# EAGLE design UDB5-v010 (EAGLE 6.4)

## Sheet 1 of 3
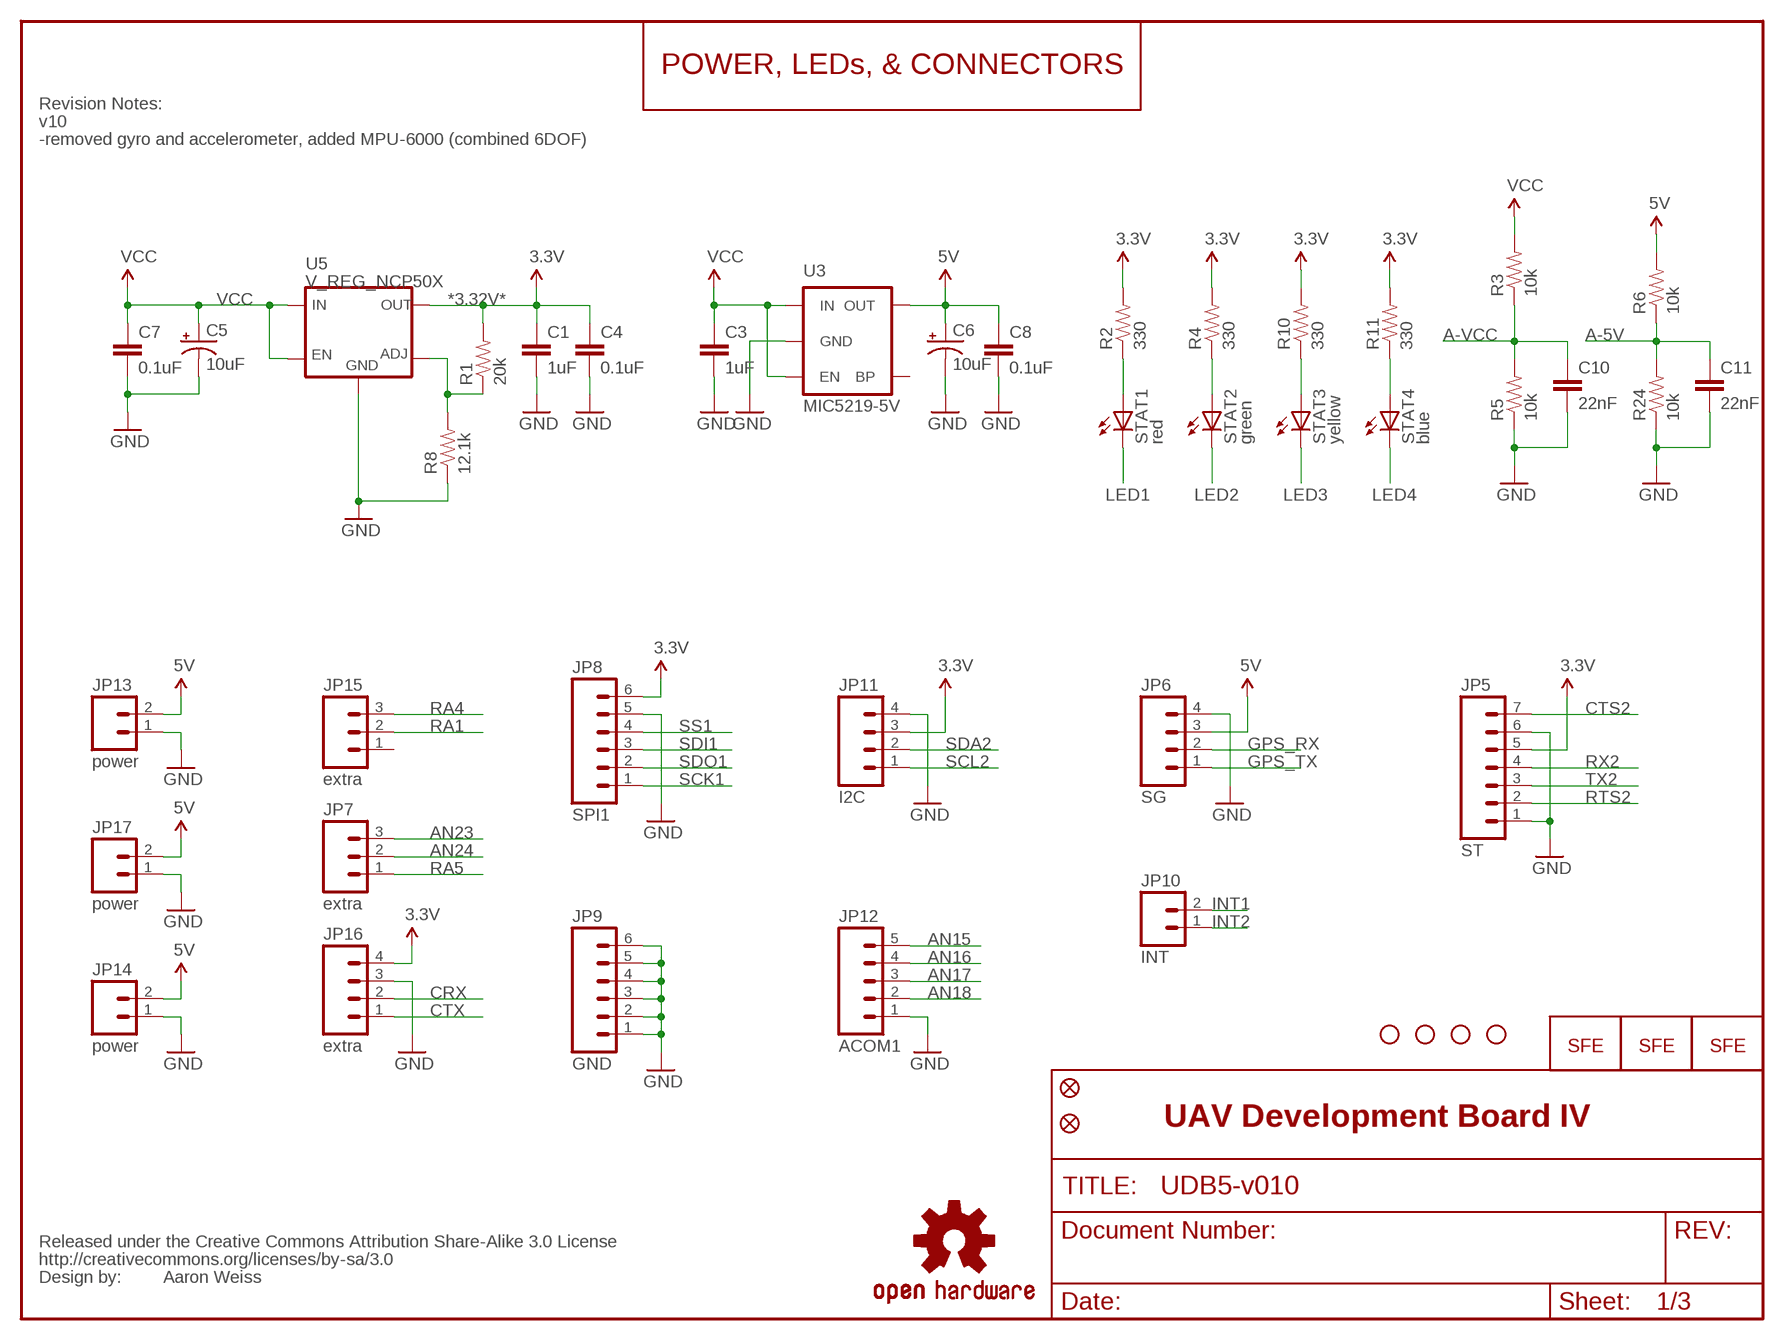
[diagram p0: schematic, sheet 1]

### Parts
C1  1uF  CAP0402-CAP  [0402-CAP]
C3  1uF  CAP0402-CAP  [0402-CAP]
C4  0.1uF  CAP0402-CAP  [0402-CAP]
C5  10uF  CAP_POL1206  [EIA3216]
C6  10uF  CAP_POL1206  [EIA3216]
C7  0.1uF  CAP0402-CAP  [0402-CAP]
C8  0.1uF  CAP0402-CAP  [0402-CAP]
C10  22nF  CAP0402-CAP  [0402-CAP]
C11  22nF  CAP0402-CAP  [0402-CAP]
CC_TEXT1  CREATIVE_COMMONS  [CREATIVE_COMMONS]
JP3  LOGO-SFENEW  [SFE-NEW-WEBLOGO]
JP5  ST  M07  [1X07]
JP6  SG  M04PTH  [1X04]
JP7  extra  M03PTH  [1X03]
JP8  SPI1  M06SIP  [1X06]
JP9  GND  M06SIP  [1X06]
JP10  INT  M02PTH  [1X02]
JP11  I2C  M04PTH  [1X04]
JP12  ACOM1  M05PTH  [1X05]
JP13  power  M02PTH  [1X02]
JP14  power  M02PTH  [1X02]
JP15  extra  M03PTH  [1X03]
JP16  extra  M04PTH  [1X04]
JP17  power  M02PTH  [1X02]
JP18  FIDUCIAL1X2.5  [FIDUCIAL-1X2.5]
JP19  FIDUCIAL1X2.5  [FIDUCIAL-1X2.5]
LOGO1  LOGO-SFENW2  [SFE-NEW-WEB]
R1  20k  RESISTOR0402-RES  [0402-RES]
R2  330  RESISTOR0402-RES  [0402-RES]
R3  10k  RESISTOR0402-RES  [0402-RES]
R4  330  RESISTOR0402-RES  [0402-RES]
R5  10k  RESISTOR0402-RES  [0402-RES]
R6  10k  RESISTOR0402-RES  [0402-RES]
R8  12.1k  RESISTOR0402-RES  [0402-RES]
R10  330  RESISTOR0402-RES  [0402-RES]
R11  330  RESISTOR0402-RES  [0402-RES]
R24  10k  RESISTOR0402-RES  [0402-RES]
STAT1  red  LED0603  [LED-0603]
STAT2  green  LED0603  [LED-0603]
STAT3  yellow  LED0603  [LED-0603]
STAT4  blue  LED0603  [LED-0603]
U3  V_REG_LDOSMD  [SOT23-5]
U5  V_REG_NCP50X  [DPAK-5]
U$2  STAND-OFF  [STAND-OFF]
U$3  STAND-OFF  [STAND-OFF]
U$4  STAND-OFF  [STAND-OFF]
U$5  STAND-OFF  [STAND-OFF]
U$9  OSHW-LOGOS  [OSHW-LOGO-S]
U$10  LOGO-SFESK  [SFE-LOGO-FLAME]

### Nets
3.3V: C1.1 C4.1 JP5.5 JP8.6 JP11.3 JP16.4 R1.2 R2.2 R4.2 R10.2 R11.2 U5.VOUT(OUT) ; also sheet 2,3
5V: C6.A(+) C8.1 JP6.3 JP13.2 JP14.2 JP17.2 R6.2 U3.5(OUT) ; also sheet 3
A-5V: C11.1 R6.1 R24.2 ; also sheet 2
A-VCC: C10.1 R3.1 R5.2 ; also sheet 2
AN15: JP12.5 ; also sheet 2
AN16: JP12.4 ; also sheet 2
AN17: JP12.3 ; also sheet 2
AN18: JP12.2 ; also sheet 2
AN23: JP7.3 ; also sheet 2
AN24: JP7.2 ; also sheet 2
CRX: JP16.2 ; also sheet 2
CTS2: JP5.7 ; also sheet 2
CTX: JP16.1 ; also sheet 2
GND: C1.2 C3.2 C4.2 C5.C(-) C6.C(-) C7.2 C8.2 C10.2 C11.2 JP5.1 JP5.6 JP6.4 JP8.5 JP9.1 JP9.2 JP9.3 JP9.4 JP9.5 JP9.6 JP11.4 JP12.1 JP13.1 JP14.1 JP16.3 JP17.1 R5.1 R8.1 R24.1 U3.2(GND) U5.GND ; also sheet 2,3
GPS_RX: JP6.2 ; also sheet 2,3
GPS_TX: JP6.1 ; also sheet 2,3
INT1: JP10.2 ; also sheet 2
INT2: JP10.1 ; also sheet 2
LED1: STAT1.C ; also sheet 2
LED2: STAT2.C ; also sheet 2
LED3: STAT3.C ; also sheet 2
LED4: STAT4.C ; also sheet 2
N$1: R2.1 STAT1.A
N$2: R4.1 STAT2.A
N$9: R1.1 R8.2 U5.ADJ
N$33: R10.1 STAT3.A
N$34: R11.1 STAT4.A
RA1: JP15.2 ; also sheet 2
RA4: JP15.3 ; also sheet 2
RA5: JP7.1 ; also sheet 2
RTS2: JP5.2 ; also sheet 2
RX2: JP5.4 ; also sheet 2
SCK1: JP8.1 ; also sheet 2
SCL2: JP11.1 ; also sheet 2
SDA2: JP11.2 ; also sheet 2
SDI1: JP8.3 ; also sheet 2
SDO1: JP8.2 ; also sheet 2
SS1: JP8.4 ; also sheet 2
TX2: JP5.3 ; also sheet 2
VCC: C3.1 C5.A(+) C7.1 R3.2 U3.1(IN) U3.3(EN) U5.EN U5.VIN(IN) ; also sheet 3
Unconnected: JP15.1 U3.4(BP)

### Notes on the sheet
- POWER, LEDs, & CONNECTORS
- Revision Notes:
- v10
- -removed gyro and accelerometer, added MPU-6000 (combined 6DOF)
- *3.32V*
- MIC5219-5V
- UAV Development Board IV
- Aaron Weiss

## Sheet 2 of 3
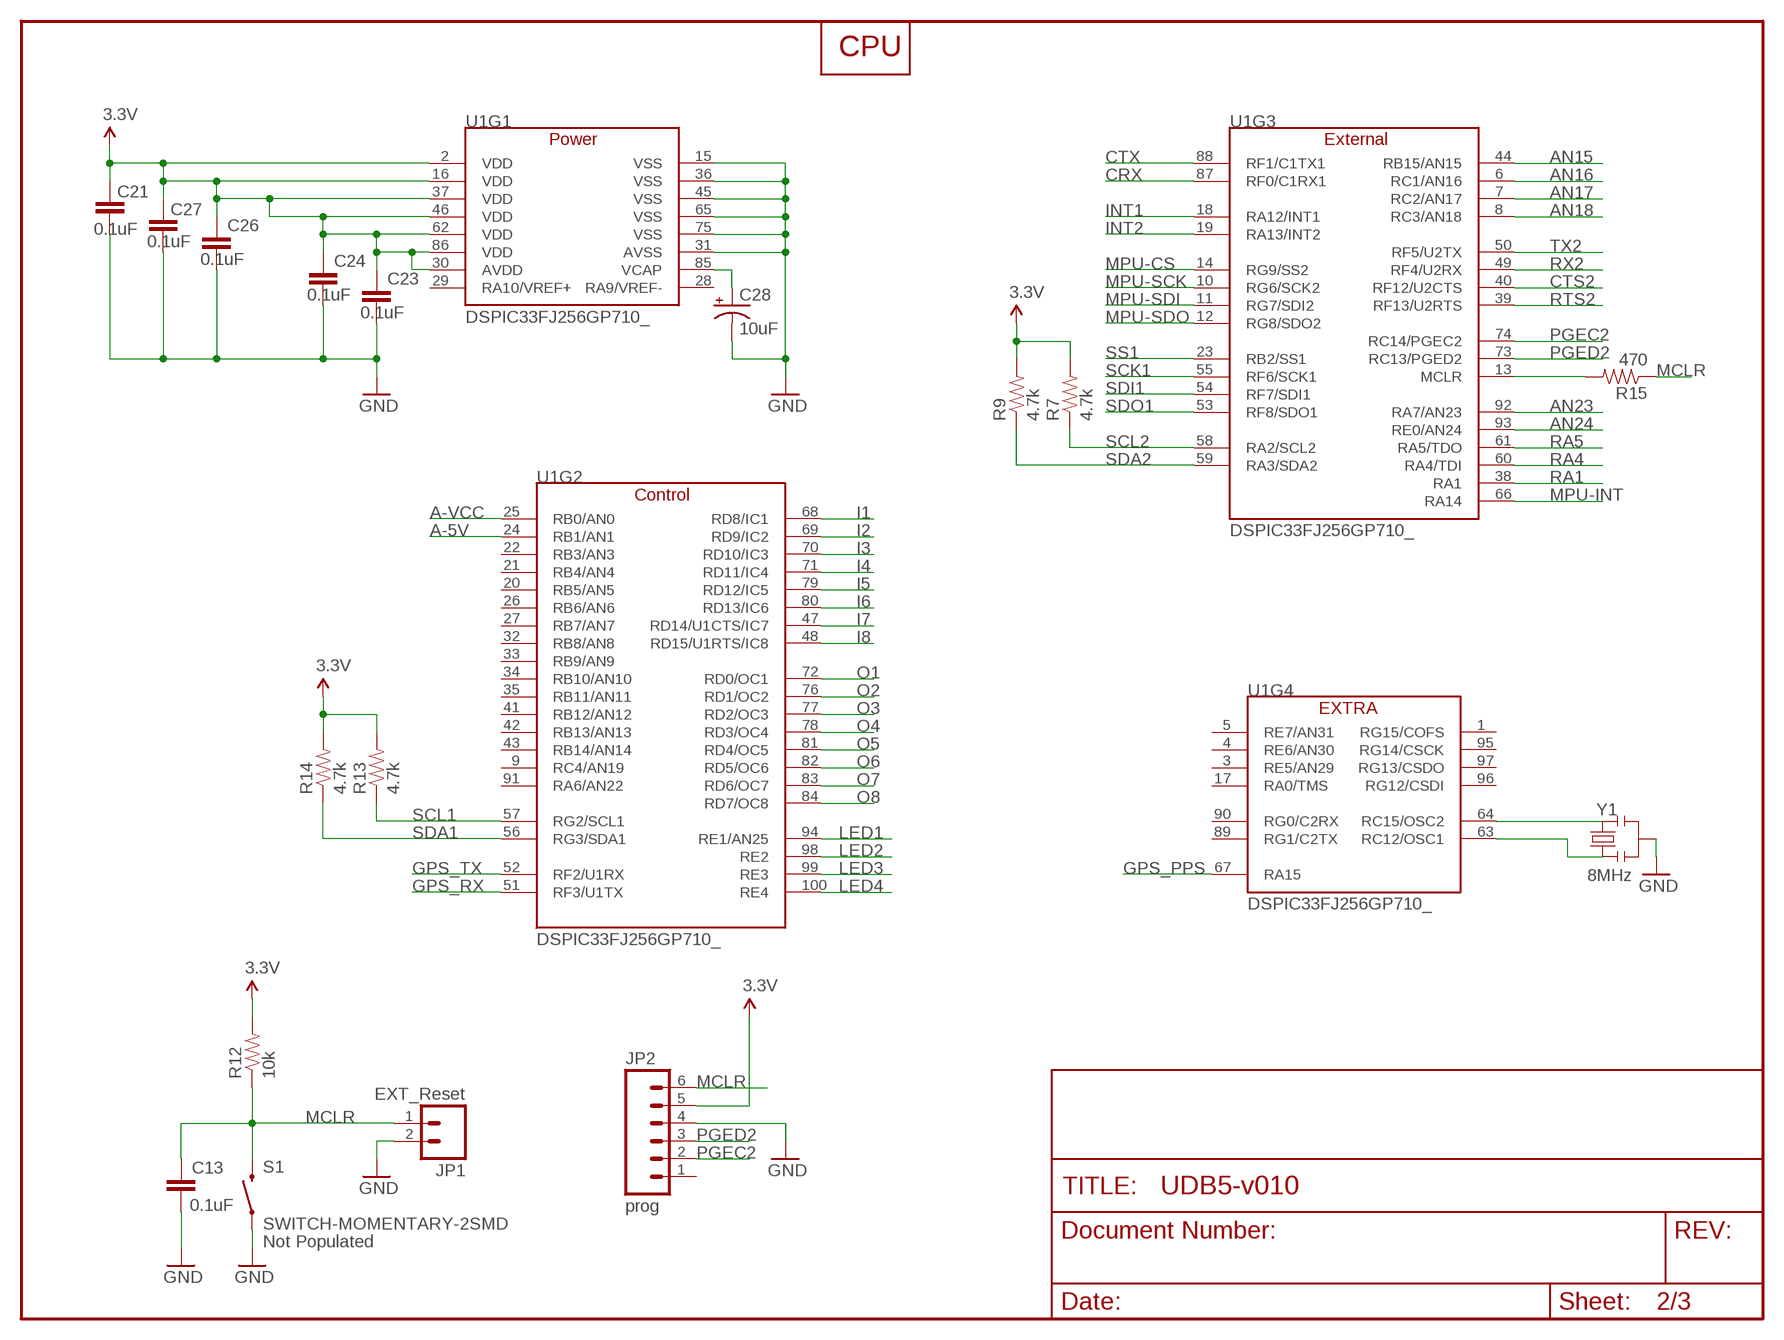
[diagram p1: schematic, sheet 2]

### Parts
C13  0.1uF  CAP0402-CAP  [0402-CAP]
C21  0.1uF  CAP0402-CAP  [0402-CAP]
C23  0.1uF  CAP0402-CAP  [0402-CAP]
C24  0.1uF  CAP0402-CAP  [0402-CAP]
C26  0.1uF  CAP0402-CAP  [0402-CAP]
C27  0.1uF  CAP0402-CAP  [0402-CAP]
C28  10uF  CAP_POL1206  [EIA3216]
JP1  EXT_Reset  M02PTH  [1X02]
JP2  prog  M06SIP  [1X06]
R7  4.7k  RESISTOR0402-RES  [0402-RES]
R9  4.7k  RESISTOR0402-RES  [0402-RES]
R12  10k  RESISTOR0402-RES  [0402-RES]
R13  4.7k  RESISTOR0402-RES  [0402-RES]
R14  4.7k  RESISTOR0402-RES  [0402-RES]
R15  470  RESISTOR0402-RES  [0402-RES]
S1  SWITCH-MOMENTARY-2SMD  [TACTILE_SWITCH_SMD]
U1  DSPIC33FJ256GP710_  [TQFP-100-12X12MM]
Y1  RESONATORSMD  [RESONATOR-SMD]

### Nets
3.3V: C21.1 C23.1 C24.1 C26.1 C27.1 JP2.5 R7.2 R9.2 R12.2 R13.2 R14.2 U1.2(VDD) U1.16(VDD) U1.30(AVDD) U1.37(VDD) U1.46(VDD) U1.62(VDD) U1.86(VDD) ; also sheet 1,3
A-5V: U1.24(RB1/AN1) ; also sheet 1
A-VCC: U1.25(RB0/AN0) ; also sheet 1
AN15: U1.44(RB15/AN15) ; also sheet 1
AN16: U1.6(RC1/AN16) ; also sheet 1
AN17: U1.7(RC2/AN17) ; also sheet 1
AN18: U1.8(RC3/AN18) ; also sheet 1
AN23: U1.92(RA7/AN23) ; also sheet 1
AN24: U1.93(RE0/AN24) ; also sheet 1
CRX: U1.87(RF0/C1RX1) ; also sheet 1
CTS2: U1.40(RF12/U2CTS) ; also sheet 1
CTX: U1.88(RF1/C1TX1) ; also sheet 1
GND: C13.2 C21.2 C23.2 C24.2 C26.2 C27.2 C28.C(-) JP1.2 JP2.4 S1.1 U1.15(VSS) U1.31(AVSS) U1.36(VSS) U1.45(VSS) U1.65(VSS) U1.75(VSS) Y1.2 ; also sheet 1,3
GPS_PPS: U1.67(RA15) ; also sheet 3
GPS_RX: U1.51(RF3/U1TX) ; also sheet 1,3
GPS_TX: U1.52(RF2/U1RX) ; also sheet 1,3
I1: U1.68(RD8/IC1) ; also sheet 3
I2: U1.69(RD9/IC2) ; also sheet 3
I3: U1.70(RD10/IC3) ; also sheet 3
I4: U1.71(RD11/IC4) ; also sheet 3
I5: U1.79(RD12/IC5) ; also sheet 3
I6: U1.80(RD13/IC6) ; also sheet 3
I7: U1.47(RD14/U1CTS/IC7) ; also sheet 3
I8: U1.48(RD15/U1RTS/IC8) ; also sheet 3
INT1: U1.18(RA12/INT1) ; also sheet 1
INT2: U1.19(RA13/INT2) ; also sheet 1
LED1: U1.94(RE1/AN25) ; also sheet 1
LED2: U1.98(RE2) ; also sheet 1
LED3: U1.99(RE3) ; also sheet 1
LED4: U1.100(RE4) ; also sheet 1
MCLR: C13.1 JP1.1 JP2.6 R12.1 R15.1 S1.3
MPU-CS: U1.14(RG9/SS2) ; also sheet 3
MPU-INT: U1.66(RA14) ; also sheet 3
MPU-SCK: U1.10(RG6/SCK2) ; also sheet 3
MPU-SDI: U1.11(RG7/SDI2) ; also sheet 3
MPU-SDO: U1.12(RG8/SDO2) ; also sheet 3
N$3: U1.64(RC15/OSC2) Y1.3
N$6: U1.63(RC12/OSC1) Y1.1
N$7: R15.2 U1.13(MCLR)
N$35: C28.A(+) U1.85(VCAP)
O1: U1.72(RD0/OC1) ; also sheet 3
O2: U1.76(RD1/OC2) ; also sheet 3
O3: U1.77(RD2/OC3) ; also sheet 3
O4: U1.78(RD3/OC4) ; also sheet 3
O5: U1.81(RD4/OC5) ; also sheet 3
O6: U1.82(RD5/OC6) ; also sheet 3
O7: U1.83(RD6/OC7) ; also sheet 3
O8: U1.84(RD7/OC8) ; also sheet 3
PGEC2: JP2.2 U1.74(RC14/PGEC2)
PGED2: JP2.3 U1.73(RC13/PGED2)
RA1: U1.38(RA1) ; also sheet 1
RA4: U1.60(RA4/TDI) ; also sheet 1
RA5: U1.61(RA5/TDO) ; also sheet 1
RTS2: U1.39(RF13/U2RTS) ; also sheet 1
RX2: U1.49(RF4/U2RX) ; also sheet 1
SCK1: U1.55(RF6/SCK1) ; also sheet 1
SCL1: R13.1 U1.57(RG2/SCL1) ; also sheet 3
SCL2: R7.1 U1.58(RA2/SCL2) ; also sheet 1
SDA1: R14.1 U1.56(RG3/SDA1) ; also sheet 3
SDA2: R9.1 U1.59(RA3/SDA2) ; also sheet 1
SDI1: U1.54(RF7/SDI1) ; also sheet 1
SDO1: U1.53(RF8/SDO1) ; also sheet 1
SS1: U1.23(RB2/SS1) ; also sheet 1
TX2: U1.50(RF5/U2TX) ; also sheet 1
Unconnected: JP2.1 U1.1(RG15/COFS) U1.3(RE5/AN29) U1.4(RE6/AN30) U1.5(RE7/AN31) U1.9(RC4/AN19) U1.17(RA0/TMS) U1.20(RB5/AN5) U1.21(RB4/AN4) U1.22(RB3/AN3) U1.26(RB6/AN6) U1.27(RB7/AN7) U1.28(RA9/VREF-) U1.29(RA10/VREF+) U1.32(RB8/AN8) U1.33(RB9/AN9) U1.34(RB10/AN10) U1.35(RB11/AN11) U1.41(RB12/AN12) U1.42(RB13/AN13) U1.43(RB14/AN14) U1.89(RG1/C2TX) U1.90(RG0/C2RX) U1.91(RA6/AN22) U1.95(RG14/CSCK) U1.96(RG12/CSDI) U1.97(RG13/CSDO)

### Notes on the sheet
- CPU
- 8MHz
- Not Populated

## Sheet 3 of 3
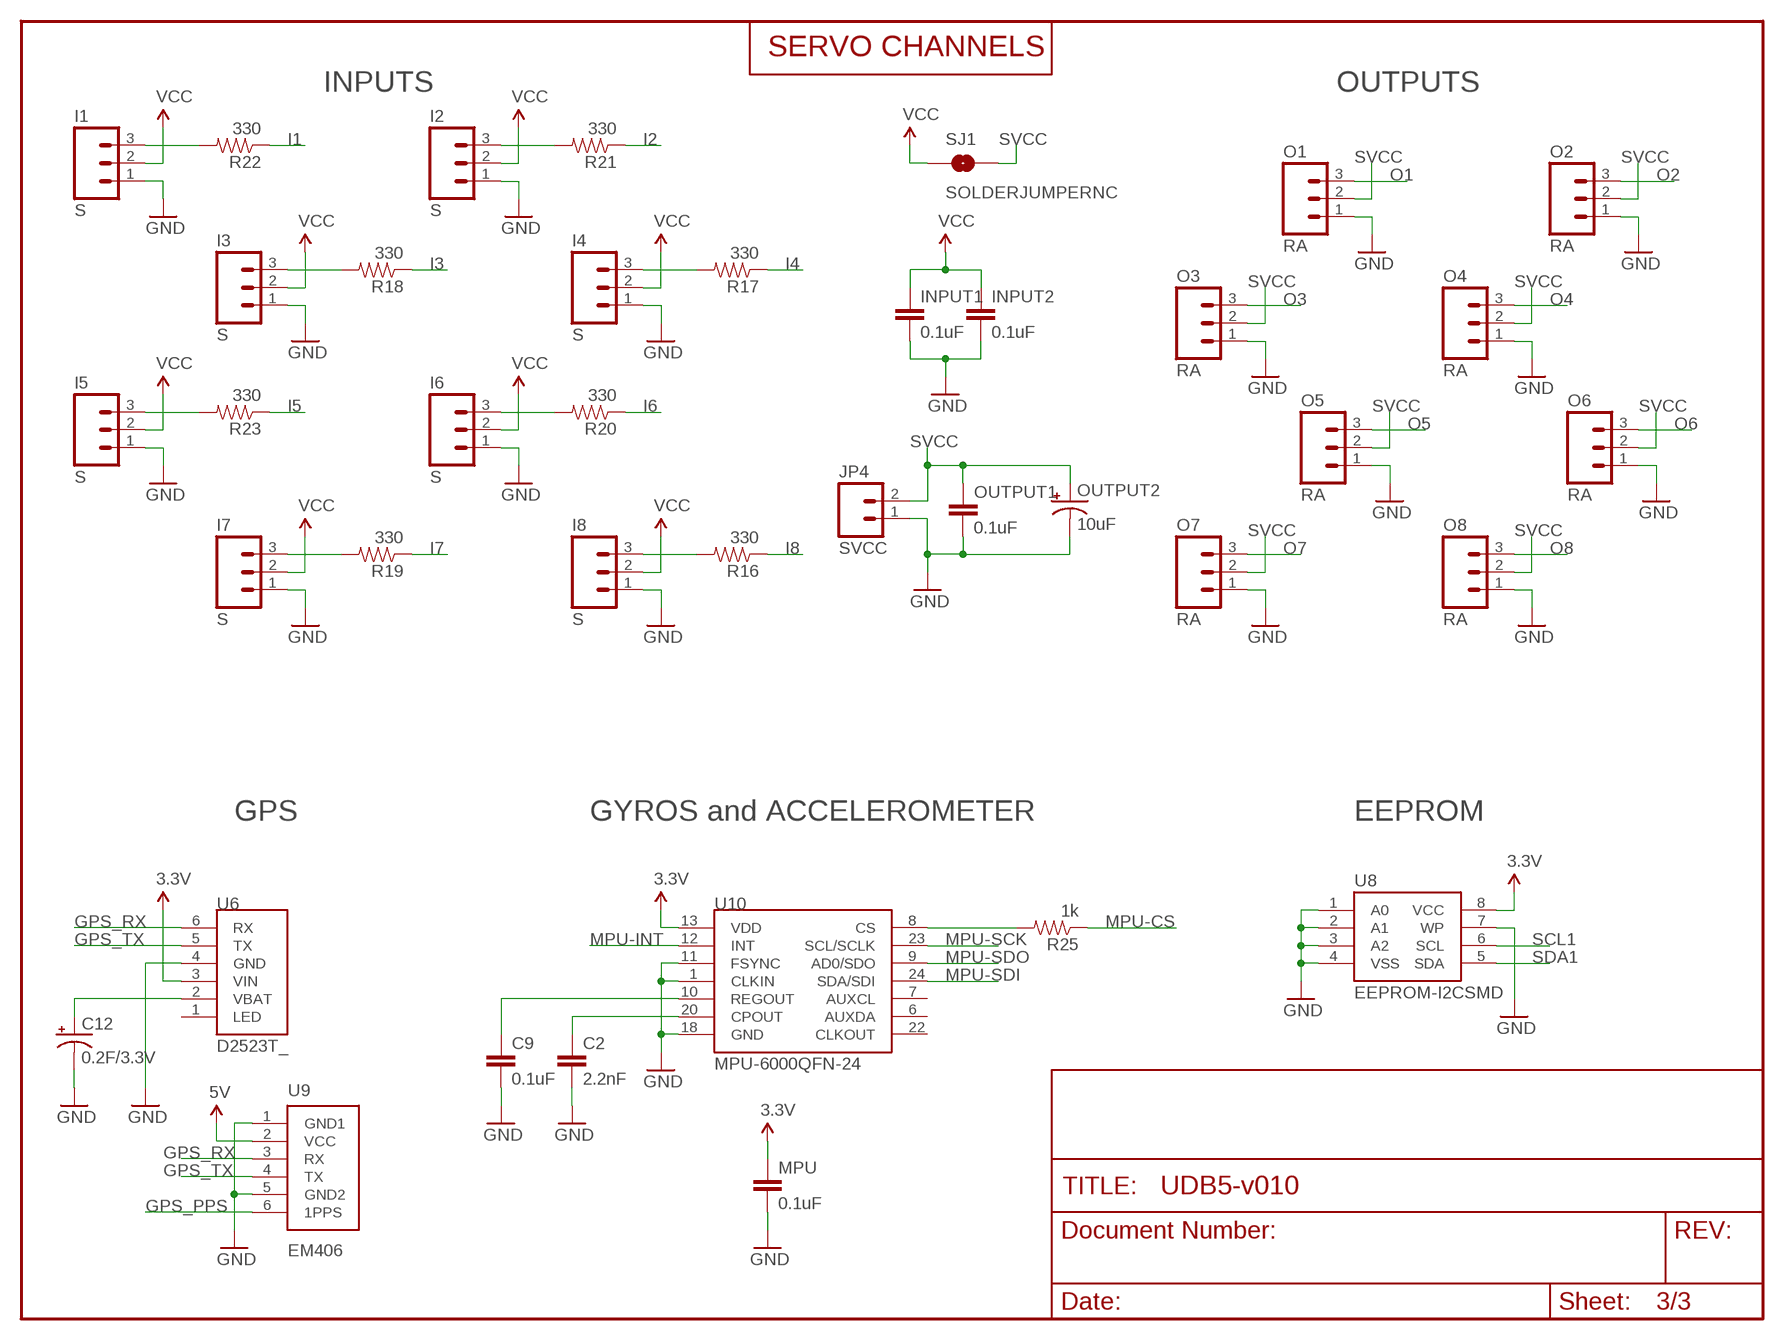
[diagram p2: schematic, sheet 3]

### Parts
C2  2.2nF  CAP0402-CAP  [0402-CAP]
C9  0.1uF  CAP0402-CAP  [0402-CAP]
C12  0.2F/3.3V  CAP_POLEN_J2  [EN_J2]
I1  S  M03PTH  [1X03]
I2  S  M03PTH  [1X03]
I3  S  M03PTH  [1X03]
I4  S  M03PTH  [1X03]
I5  S  M03PTH  [1X03]
I6  S  M03PTH  [1X03]
I7  S  M03PTH  [1X03]
I8  S  M03PTH  [1X03]
INPUT1  0.1uF  CAP0402-CAP  [0402-CAP]
INPUT2  0.1uF  CAP0402-CAP  [0402-CAP]
JP4  SVCC  M02PTH  [1X02]
MPU  0.1uF  CAP0402-CAP  [0402-CAP]
O1  RA  M03PTH  [1X03]
O2  RA  M03PTH  [1X03]
O3  RA  M03PTH  [1X03]
O4  RA  M03PTH  [1X03]
O5  RA  M03PTH  [1X03]
O6  RA  M03PTH  [1X03]
O7  RA  M03PTH  [1X03]
O8  RA  M03PTH  [1X03]
OUTPUT1  0.1uF  CAP0402-CAP  [0402-CAP]
OUTPUT2  10uF  CAP_POL1206  [EIA3216]
R16  330  RESISTOR0402-RES  [0402-RES]
R17  330  RESISTOR0402-RES  [0402-RES]
R18  330  RESISTOR0402-RES  [0402-RES]
R19  330  RESISTOR0402-RES  [0402-RES]
R20  330  RESISTOR0402-RES  [0402-RES]
R21  330  RESISTOR0402-RES  [0402-RES]
R22  330  RESISTOR0402-RES  [0402-RES]
R23  330  RESISTOR0402-RES  [0402-RES]
R25  1k  RESISTOR0402-RES  [0402-RES]
SJ1  SOLDERJUMPERNC  [SJ_2S]
U6  D2523T_  [EM406]
U8  EEPROM-I2CSMD  [SO08]
U9  EM406  [EM406]
U10  MPU-6000QFN-24  [QFN-24-TESTING]

### Nets
3.3V: MPU.1 U6.3(VIN) U8.8(VCC) U10.13(VDD) ; also sheet 1,2
5V: U9.2(VCC) ; also sheet 1
GND: C2.2 C9.2 C12.- I1.1 I2.1 I3.1 I4.1 I5.1 I6.1 I7.1 I8.1 INPUT1.2 INPUT2.2 JP4.1 MPU.2 O1.1 O2.1 O3.1 O4.1 O5.1 O6.1 O7.1 O8.1 OUTPUT1.2 OUTPUT2.C(-) U6.4(GND) U8.1(A0) U8.2(A1) U8.3(A2) U8.4(VSS) U8.7(WP) U9.1(GND1) U9.5(GND2) U10.1(CLKIN) U10.11(FSYNC) U10.18(GND) ; also sheet 1,2
GPS_PPS: U9.6(1PPS) ; also sheet 2
GPS_RX: U6.6(RX) U9.3(RX) ; also sheet 1,2
GPS_TX: U6.5(TX) U9.4(TX) ; also sheet 1,2
I1: R22.1 ; also sheet 2
I2: R21.1 ; also sheet 2
I3: R18.1 ; also sheet 2
I4: R17.1 ; also sheet 2
I5: R23.1 ; also sheet 2
I6: R20.1 ; also sheet 2
I7: R19.1 ; also sheet 2
I8: R16.1 ; also sheet 2
MPU-CS: R25.1 ; also sheet 2
MPU-INT: U10.12(INT) ; also sheet 2
MPU-SCK: U10.23(SCL/SCLK) ; also sheet 2
MPU-SDI: U10.24(SDA/SDI) ; also sheet 2
MPU-SDO: U10.9(AD0/SDO) ; also sheet 2
N$4: C12.+ U6.2(VBAT)
N$5: R25.2 U10.8(CS)
N$13: C2.1 U10.20(CPOUT)
N$14: I8.3 R16.2
N$15: I4.3 R17.2
N$16: C9.1 U10.10(REGOUT)
N$17: I3.3 R18.2
N$18: I7.3 R19.2
N$19: I6.3 R20.2
N$20: I2.3 R21.2
N$21: I1.3 R22.2
N$27: I5.3 R23.2
O1: O1.3 ; also sheet 2
O2: O2.3 ; also sheet 2
O3: O3.3 ; also sheet 2
O4: O4.3 ; also sheet 2
O5: O5.3 ; also sheet 2
O6: O6.3 ; also sheet 2
O7: O7.3 ; also sheet 2
O8: O8.3 ; also sheet 2
SCL1: U8.6(SCL) ; also sheet 2
SDA1: U8.5(SDA) ; also sheet 2
SVCC: JP4.2 O1.2 O2.2 O3.2 O4.2 O5.2 O6.2 O7.2 O8.2 OUTPUT1.1 OUTPUT2.A(+) SJ1.2
VCC: I1.2 I2.2 I3.2 I4.2 I5.2 I6.2 I7.2 I8.2 INPUT1.1 INPUT2.1 SJ1.1 ; also sheet 1
Unconnected: U6.1(LED) U10.6(AUXDA) U10.7(AUXCL) U10.22(CLKOUT)

### Notes on the sheet
- SERVO CHANNELS
- INPUTS | OUTPUTS
- GPS | GYROS and ACCELEROMETER | EEPROM

## Library data of the parts
C1 C3 C4 C7 C8 C10 C11 C13 C21 C23 C24 C26 C27 INPUT1 INPUT2 MPU OUTPUT1 = SparkFun:CAP: Capacitor Standard 0603 ceramic capacitor, and 0.1" leaded capacitor.
C2 C9 = SparkFun-Capacitors:CAP: Capacitor Standard 0603 ceramic capacitor, and 0.1" leaded capacitor.
C5 C6 C28 OUTPUT2 = SparkFun:CAP_POL: Capacitor Polarized These are standard SMD and PTH capacitors. Normally 10uF, 47uF, and 100uF in electrolytic and tantalum varieties. Always verify the external diameter of the through hole cap, it varies with capacity, voltage, and manufacturer. The EIA devices should be standard.
C12 = SparkFun-Capacitors:CAP_POL: Capacitor Polarized These are standard SMD and PTH capacitors. Normally 10uF, 47uF, and 100uF in electrolytic and tantalum varieties. Always verify the external diameter of the through hole cap, it varies with capacity, voltage, and manufacturer. The EIA devices should be standard.
CC_TEXT1 = SparkFun-Aesthetics:CREATIVE_COMMONS: Creative Commons License summary
I1-I8 JP7 JP15 O1-O8 = SparkFun:M03: Header 3 Standard 3-pin 0.1" header. Use with straight break away headers (SKU : PRT-00116), right angle break away headers (PRT-00553), swiss pins (PRT-00743), machine pins (PRT-00117), and female headers (PRT-00115). Molex polarized connector foot print use with SKU : PRT-08232 with associated crimp pins and housings.
JP1 JP4 JP10 JP13 JP14 JP17 = SparkFun:M02: Header 2 Standard 2-pin 0.1" header. Use with straight break away headers (SKU : PRT-00116), right angle break away headers (PRT-00553), swiss pins (PRT-00743), machine pins (PRT-00117), and female headers (PRT-00115). Molex polarized connector foot print use with SKU : PRT-08233 with associated crimp pins and housings.
JP2 JP8 = SparkFun:M06: Header 6 Standard 6-pin 0.1" header. Use with straight break away headers (SKU : PRT-00116), right angle break away headers (PRT-00553), swiss pins (PRT-00743), machine pins (PRT-00117), and female headers (PRT-00115). Molex polarized connector foot print use with SKU : PRT-08094 with associated crimp pins and housings. NOTES ON THE VARIANTS LOCK and LOCK_LONGPADS... This footprint was designed to help hold the alignment of a through-hole component (i.e. 6-pin header) while soldering it into place. You may notice that each hole has been shifted either up or down by 0.005 of an inch from it's more standard position (which is a perfectly straight line). This slight alteration caused the pins (the squares in the middle) to touch the edges of the holes. Because they are alternating, it causes a "brace" to hold the component in place. 0.005 has proven to be the perfect amount of "off-center" position when using our standard breakaway headers. Although looks a little odd when you look at the bare footprint, once you have a header in there, the alteration is very hard to notice. Also, if you push a header all the way into place, it is covered up entirely on the bottom side. This idea of altering the position of holes to aid alignment will be further integrated into the Sparkfun Library for other footprints. It can help hold any component with 3 or more connection pins.
JP3 U$10 = SparkFun:LOGO-SFE: Spark Fun Electronics PCB Logo This is the standard Spark Fun Electronics PCB logo.
JP5 = SparkFun:M07: Header 7 Standard 7-pin 0.1" header. Use with straight break away headers (SKU : PRT-00116), right angle break away headers (PRT-00553), swiss pins (PRT-00743), machine pins (PRT-00117), and female headers (PRT-00115). NOTES ON THE VARIANTS LOCK and LOCK_LONGPADS... This footprint was designed to help hold the alignment of a through-hole component (i.e. 7-pin header) while soldering it into place. You may notice that each hole has been shifted either up or down by 0.005 of an inch from it's more standard position (which is usually a perfectly straight line). This slight alteration caused the pins (the squares in the middle) to touch the edges of the holes. Because they are alternating, it causes a "brace" to hold the header in place. 0.005 has proven to be the perfect amount of "off-center" position when using our standard breakaway headers. Although looks a little odd when you look at the bare footprint, once you have a header in there, the alteration is very hard to notice. Also, if you push a header all the way into place, it is covered up entirely on the bottom side. This idea of altering the position of holes to aid alignment will be further integrated into the Sparkfun Library for other footprints. It can help hold any component with 3 or more connection pins.
JP6 JP11 JP16 = SparkFun:M04: Header 4 Standard 4-pin 0.1" header. Use with straight break away headers (SKU : PRT-00116), right angle break away headers (PRT-00553), swiss pins (PRT-00743), machine pins (PRT-00117), and female headers (PRT-00115). Molex polarized connector foot print use with SKU : PRT-08231 with associated crimp pins and housings. 1MM SMD Version SKU: PRT-10208
JP9 = SparkFun-Connectors:M06: Header 6 Standard 6-pin 0.1" header. Use with straight break away headers (SKU : PRT-00116), right angle break away headers (PRT-00553), swiss pins (PRT-00743), machine pins (PRT-00117), and female headers (PRT-00115). Molex polarized connector foot print use with SKU : PRT-08094 with associated crimp pins and housings. NOTES ON THE VARIANTS LOCK and LOCK_LONGPADS... This footprint was designed to help hold the alignment of a through-hole component (i.e. 6-pin header) while soldering it into place. You may notice that each hole has been shifted either up or down by 0.005 of an inch from it's more standard position (which is a perfectly straight line). This slight alteration caused the pins (the squares in the middle) to touch the edges of the holes. Because they are alternating, it causes a "brace" to hold the component in place. 0.005 has proven to be the perfect amount of "off-center" position when using our standard breakaway headers. Although looks a little odd when you look at the bare footprint, once you have a header in there, the alteration is very hard to notice. Also, if you push a header all the way into place, it is covered up entirely on the bottom side. This idea of altering the position of holes to aid alignment will be further integrated into the Sparkfun Library for other footprints. It can help hold any component with 3 or more connection pins.
JP12 = SparkFun:M05: Header 5 Standard 5-pin 0.1" header. Use with straight break away headers (SKU : PRT-00116), right angle break away headers (PRT-00553), swiss pins (PRT-00743), machine pins (PRT-00117), and female headers (PRT-00115). Molex polarized connector foot print use with SKU : PRT-08230 with associated crimp pins and housings.
JP18 JP19 = abes:FIDUCIAL: Fiducial Alignment Points Various fiducial points for machine vision alignment.
LOGO1 = SparkFun-Aesthetics:LOGO-SFE: Spark Fun Electronics PCB Logo This is the standard Spark Fun Electronics PCB logo.
R1-R25 = SparkFun:RESISTOR: Resistor Basic schematic elements and footprints for 0603, 1206, and PTH resistors.
S1 = SparkFun:SWITCH-MOMENTARY-2
SJ1 = SparkFun:SOLDERJUMPER: Solder Jumper Standard SMD solder jumper. Used to automate production. Two varients : Normally Open and Normally Closed are the same, but have different paste layers. NC will have a large amount of paste and should jumper during reflow.
STAT1-STAT4 = SparkFun:LED: LEDs Standard schematic elements and footprints for 5mm, 3mm, 1206, and 0603 sized LEDs. 5mm - Spark Fun Electronics SKU : COM-00529 (and others)
U1 = SparkFun:DSPIC33FJ256GP710
U3 = SparkFun:V_REG_LDO: Voltage Regulator LDO Standard 150mA LDO voltage regulator in SOT-23 layout. Micrel part MIC5205. BP (by-pass) pin is used to lower output noise with 470pF cap.
U5 = SparkFun:V_REG_NCP50X: NCP550x 500mA LDO Voltage Regulator
U6 = SparkFun:D2523T: D2523T GPS Module
U8 = SparkFun:EEPROM-I2C
U9 = SparkFun:EM406: EM406 Connector Proven layout and schematic for EM406 connector. Spark Fun Electronics SKU : GPS-00579
U10 = SparkFun-Sensors:MPU-6000: MPU-6000 - I2C address is 0x68 with AD0 low and 0x69 with AD0 high.
U$2-U$5 = SparkFun:STAND-OFF: Stand Off This is the mechanical footprint for a #4 phillips button head screw. Use the keepout ring to avoid running the screw head into surrounding components. SKU : PRT-00447
U$9 = SparkFun:OSHW-LOGO: Open Source Hardware Logo This logo indicates the piece of hardware it is found on incorporates a OSHW license and/or adheres to the definition of open source hardware found here: http://freedomdefined.org/OSHW
Y1 = SparkFun:RESONATOR: Resonator Small SMD resonator. This is the itty bitty 10/20MHz resonators with built in caps. CSTCE10M0G55 and CSTCE20M0V53. Footprint has been reviewed closely but hasn't been tested yet.

## Net classes
1 antenna: width 2.974 mm

## Board
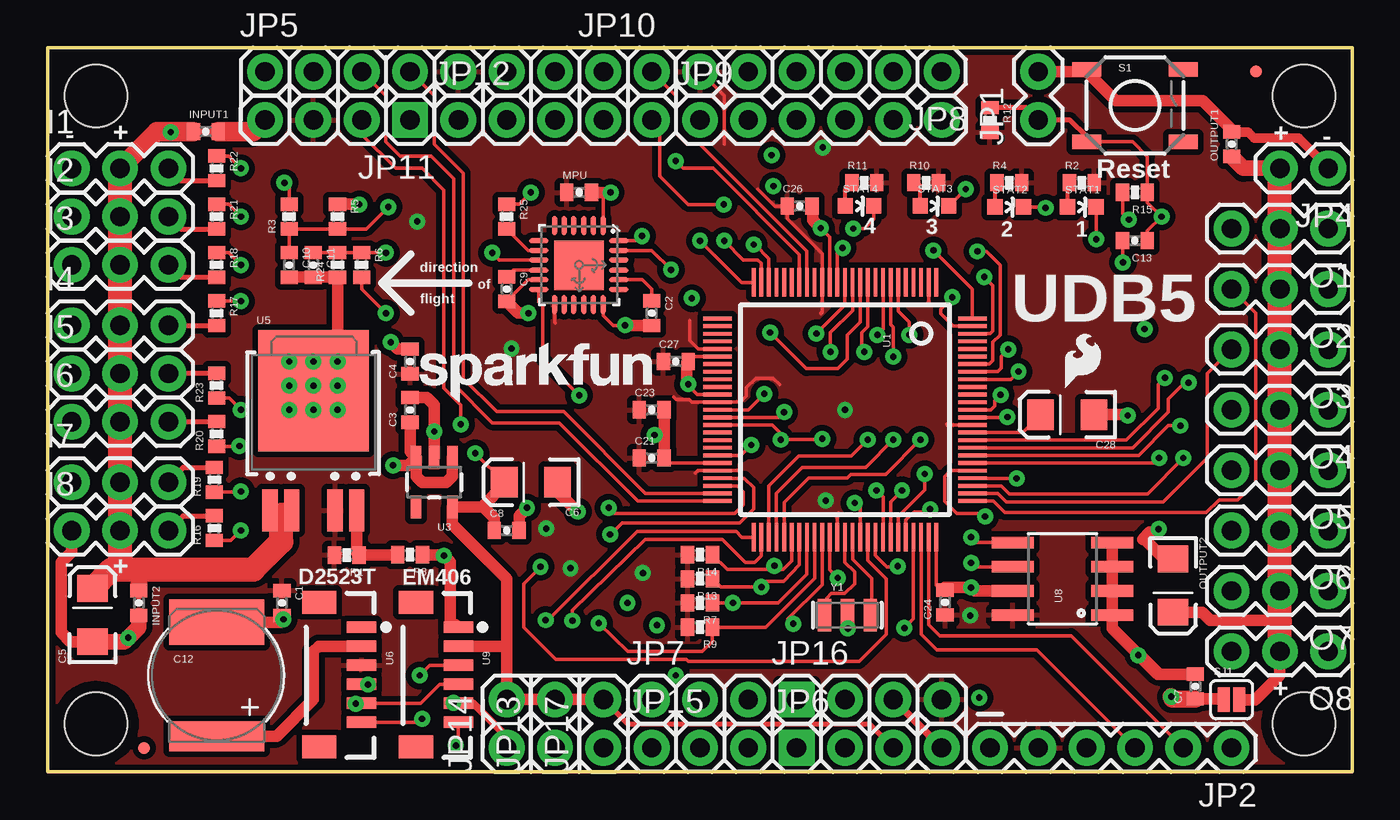
[diagram p3: board, top side]
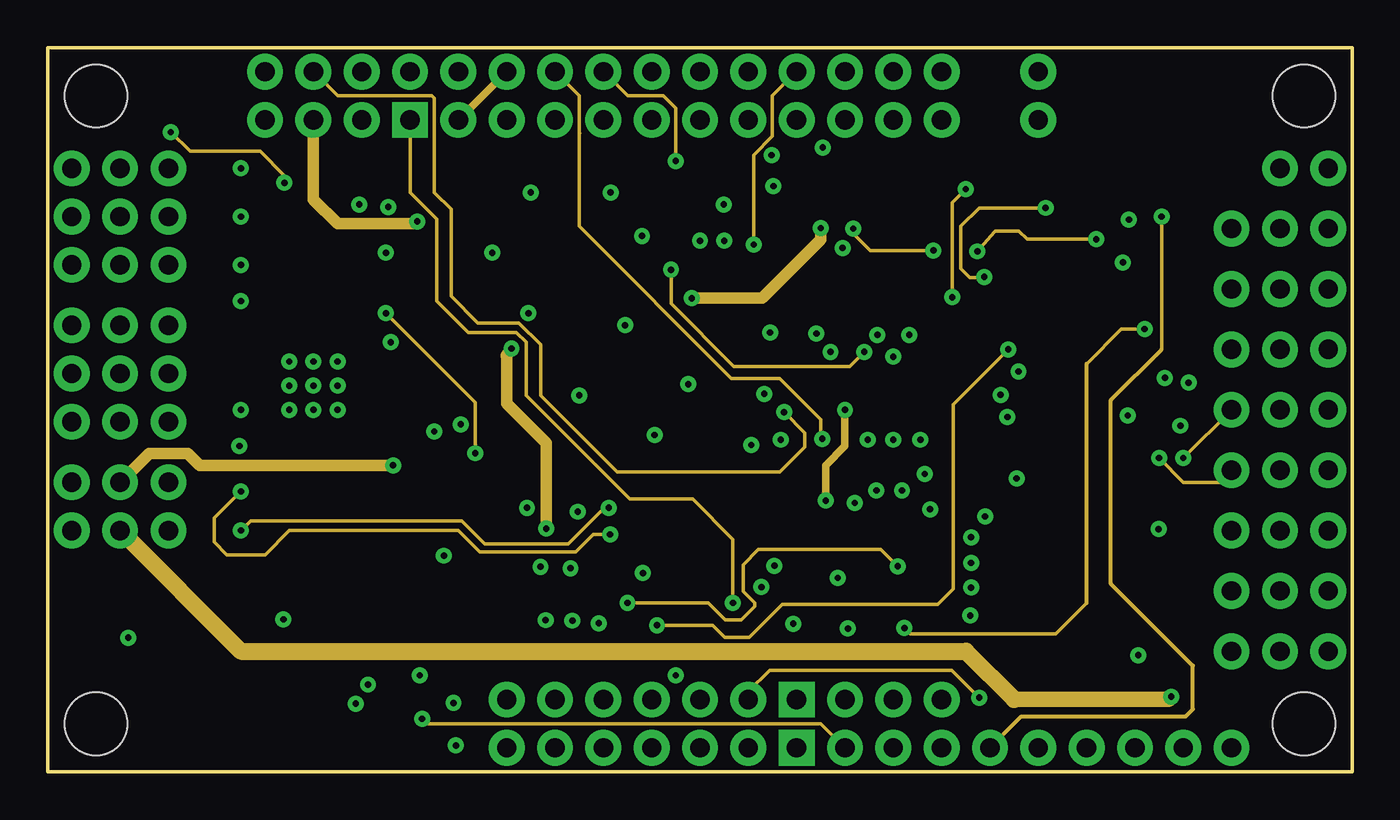
[diagram p4: board, inner layer Route5]
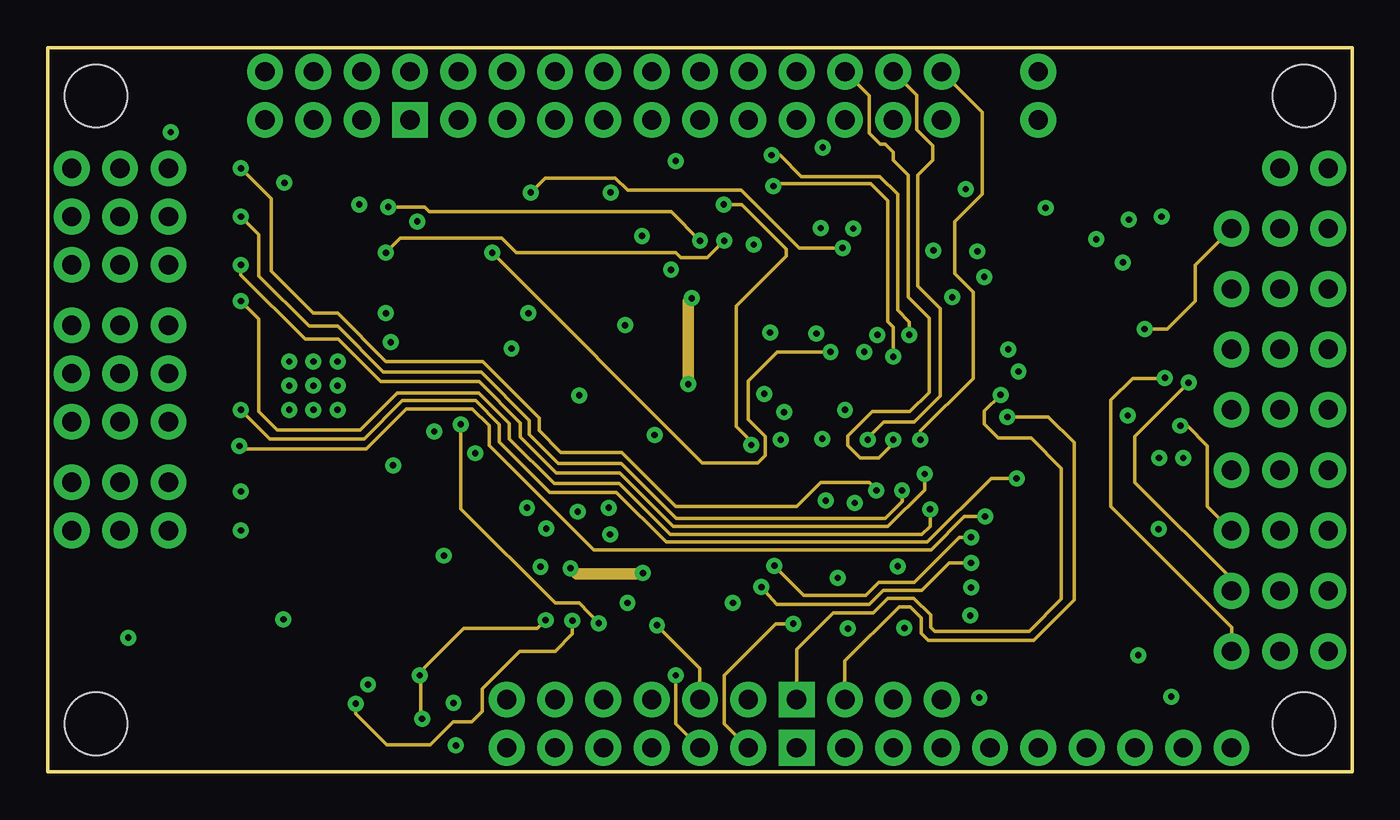
[diagram p5: board, inner layer Route10]
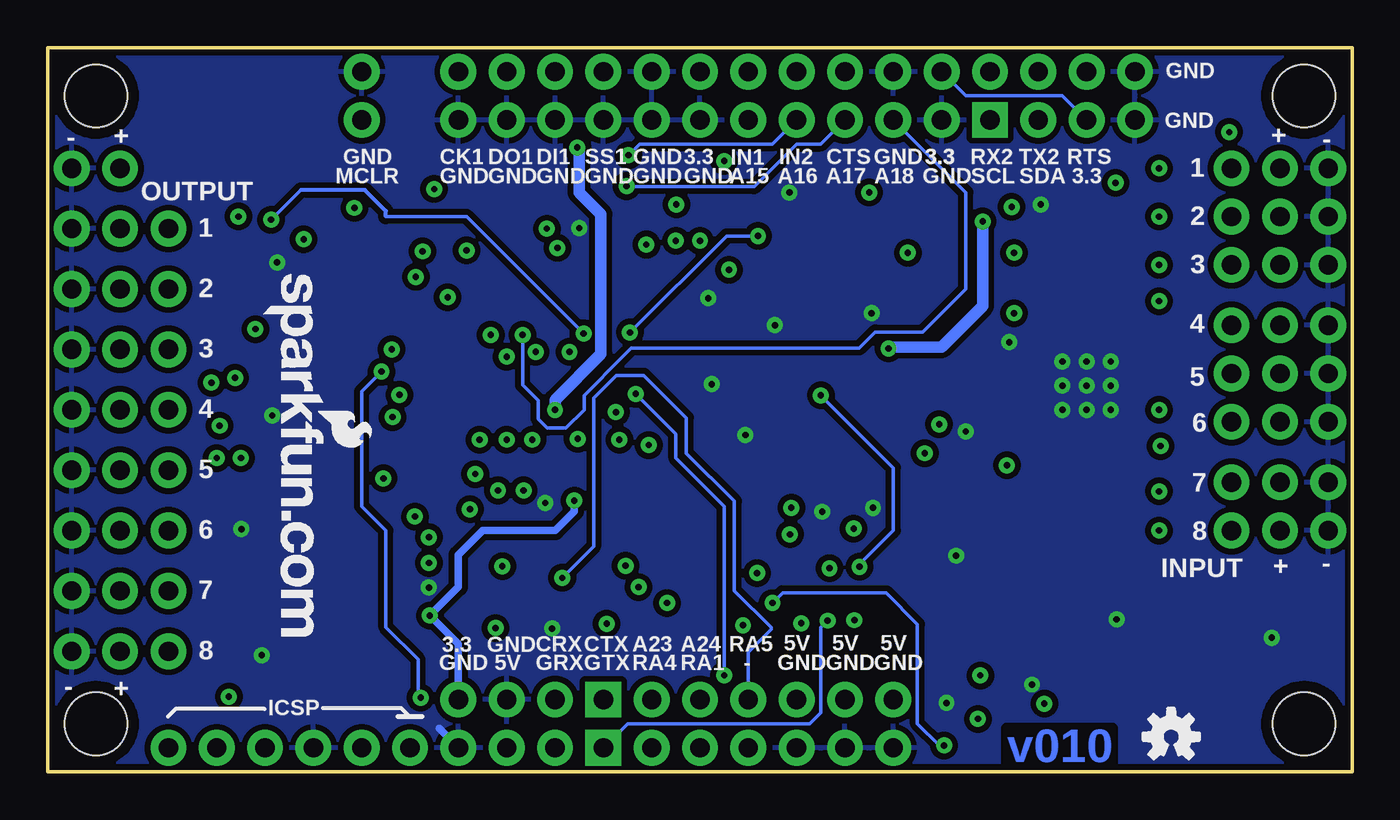
[diagram p6: board, bottom side, seen from below]

Size 68.58 x 38.1 mm. Coordinates in mm from the lower left corner, seen from the top.
Outline: 0,0 68.58,0 68.58,38.1 0,38.1 0,0
Copper layers (1*5*10*16): Top 0.035mm / dielectric 1.5mm / Route5 0.035mm / dielectric 0.2mm / Route10 0.035mm / dielectric 0.15mm / Bottom 0.035mm
Design rules "BatchPCB-4-layer *": minimum track width 6mil, minimum drill 13mil, track to track 6mil, track to pad 6mil, pad to pad 6mil, via to via 6mil, smd to smd 6mil, copper to edge 6mil, drill to drill 8mil, minimum pad ring 12mil, minimum via ring 10mil, stop-mask expansion 4mil, vias tented up to drill 20mil, thermal gap 12mil

### Footprints (pad centres in the part's own frame; a part is rotated, then mirrored left to right if it is on the bottom)
0402-CAP = smd 0.7 x 0.9: 1 -0.65,0; 2 0.65,0
EIA3216 = smd 1.4 x 1.6: A 1.4,0; C -1.4,0
EN_J2 = smd 5 x 1.6: + 0,-3.2 | smd 5 x 2.4: - 0,2.8
1X03 = drill 1.016 pad 1.88: 1 0,0; 2 2.54,0; 3 5.08,0
1X02 = drill 1.016 pad 1.88: 1 0,0; 2 2.54,0
1X06 = drill 1.016 pad 1.88: 1 0,0; 2 2.54,0; 3 5.08,0; 4 7.62,0; 5 10.16,0; 6 12.7,0
1X07 = drill 1.016 pad 1.88: 1 0,0; 2 2.54,0; 3 5.08,0; 4 7.62,0; 5 10.16,0; 6 12.7,0; 7 15.24,0
1X04 = drill 1.016 pad 1.88 square: 1 0,0 | drill 1.016 pad 1.88: 2 2.54,0; 3 5.08,0; 4 7.62,0
1X05 = drill 1.016 pad 1.88: 1 0,0; 2 2.54,0; 3 5.08,0; 4 7.62,0; 5 10.16,0
FIDUCIAL-1X2.5 = smd 0.635 x 0.635: 1 0,0
0402-RES = smd 0.7 x 0.9: 1 -0.65,0; 2 0.65,0
TACTILE_SWITCH_SMD = smd 1.524 x 0.762: 1 -2.54,1.905; 2 2.54,1.905; 3 -2.54,-1.905; 4 2.54,-1.905
SJ_2S = smd 0.635 x 1.27: 1 -0.412,0; 2 0.412,0
LED-0603 = smd 0.8 x 0.8: A 0,-0.75; C 0,0.75
TQFP-100-12X12MM = smd 1.5 x 0.2: 1 -6.7,4.8; 2 -6.7,4.4; 3 -6.7,4; 4 -6.7,3.6; 5 -6.7,3.2; 6 -6.7,2.8; 7 -6.7,2.4; 8 -6.7,2; 9 -6.7,1.6; 10 -6.7,1.2; 11 -6.7,0.8; 12 -6.7,0.4; 13 -6.7,0; 14 -6.7,-0.4; 15 -6.7,-0.8; 16 -6.7,-1.2; 17 -6.7,-1.6; 18 -6.7,-2; 19 -6.7,-2.4; 20 -6.7,-2.8; 21 -6.7,-3.2; 22 -6.7,-3.6; 23 -6.7,-4; 24 -6.7,-4.4; 25 -6.7,-4.8; 51 6.7,-4.8; 52 6.7,-4.4; 53 6.7,-4; 54 6.7,-3.6; 55 6.7,-3.2; 56 6.7,-2.8; 57 6.7,-2.4; 58 6.7,-2; 59 6.7,-1.6; 60 6.7,-1.2; 61 6.7,-0.8; 62 6.7,-0.4; 63 6.7,0; 64 6.7,0.4; 65 6.7,0.8; 66 6.7,1.2; 67 6.7,1.6; 68 6.7,2; 69 6.7,2.4; 70 6.7,2.8; 71 6.7,3.2; 72 6.7,3.6; 73 6.7,4; 74 6.7,4.4; 75 6.7,4.8 | smd 0.2 x 1.5: 26 -4.8,-6.7; 27 -4.4,-6.7; 28 -4,-6.7; 29 -3.6,-6.7; 30 -3.2,-6.7; 31 -2.8,-6.7; 32 -2.4,-6.7; 33 -2,-6.7; 34 -1.6,-6.7; 35 -1.2,-6.7; 36 -0.8,-6.7; 37 -0.4,-6.7; 38 0,-6.7; 39 0.4,-6.7; 40 0.8,-6.7; 41 1.2,-6.7; 42 1.6,-6.7; 43 2,-6.7; 44 2.4,-6.7; 45 2.8,-6.7; 46 3.2,-6.7; 47 3.6,-6.7; 48 4,-6.7; 49 4.4,-6.7; 50 4.8,-6.7; 76 4.8,6.7; 77 4.4,6.7; 78 4,6.7; 79 3.6,6.7; 80 3.2,6.7; 81 2.8,6.7; 82 2.4,6.7; 83 2,6.7; 84 1.6,6.7; 85 1.2,6.7; 86 0.8,6.7; 87 0.4,6.7; 88 0,6.7; 89 -0.4,6.7; 90 -0.8,6.7; 91 -1.2,6.7; 92 -1.6,6.7; 93 -2,6.7; 94 -2.4,6.7; 95 -2.8,6.7; 96 -3.2,6.7; 97 -3.6,6.7; 98 -4,6.7; 99 -4.4,6.7; 100 -4.8,6.7
SOT23-5 = smd 0.55 x 1.2: 1 -0.95,-1.3; 2 0,-1.3; 3 0.95,-1.3; 4 0.95,1.3; 5 -0.95,1.3
DPAK-5 = smd 0.8 x 2.2: ADJ 2.28,-5.3; EN -2.28,-5.3; VIN -1.14,-5.3; VOUT 1.14,-5.3 | smd 5.8 x 6.4: GND 0,1
EM406 = smd 0.6 x 1.55: 1 0,0; 2 1,0; 3 2,0; 4 3,0; 5 4,0; 6 5,0 | smd 1.2 x 1.8: P$1 -1.3,-2.225; P$2 6.3,-2.225
SO08 = smd 0.61 x 2.21: 1 -1.905,-2.616; 2 -0.635,-2.616; 3 0.635,-2.616; 4 1.905,-2.616; 5 1.905,2.616; 6 0.635,2.616; 7 -0.635,2.616; 8 -1.905,2.616
QFN-24-TESTING = smd 1.016 x 0.254: 1 -2.066,1.257; 2 -2.066,0.75; 3 -2.066,0.247; 4 -2.066,-0.287; 5 -2.066,-0.792; 6 -2.066,-1.297; 13 2.086,-1.297; 14 2.086,-0.792; 15 2.086,-0.287; 16 2.086,0.247; 17 2.086,0.75; 18 2.086,1.257 | smd 0.254 x 1.016: 7 -1.267,-2.122; 8 -0.762,-2.122; 9 -0.258,-2.122; 10 0.278,-2.122; 11 0.78,-2.122; 12 1.287,-2.122; 19 1.287,2.082; 20 0.78,2.082; 21 0.278,2.082; 22 -0.258,2.082; 23 -0.762,2.082; 24 -1.267,2.082 | smd 2.616 x 2.616: P$1 0.02,-0.01
STAND-OFF = hole 3.302: 0,0
RESONATOR-SMD = smd 0.7 x 1.7: 1 -1.2,0; 2 0,0; 3 1.2,0

### Placement (x,y rotation side)
C1  12.32,8.89 270 top
C2  31.75,24.13 270 top
C3  19.05,19.05 90 top
C4  19.05,21.59 90 top
C5  2.36,8.26 90 top
C6  25.4,15.24 180 top
C7  60.33,4.5 90 top
C8  24.13,12.7 0 top
C9  24.13,25.4 270 top
C10  12.7,26.67 270 top
C11  13.97,26.67 270 top
C12  8.89,5.08 0 top
C13  57.15,27.94 180 top
C21  31.75,16.51 0 top
C23  31.75,19.05 0 top
C24  47.17,8.92 90 top
C26  39.52,29.77 0 top
C27  33.02,21.59 0 top
C28  53.59,18.8 180 top
CC_TEXT1  21.59,-10.16 0 top  (outside the outline)
I1  1.27,31.75 0 top
I2  1.27,29.21 0 top
I3  1.27,26.67 0 top
I4  1.27,23.5 0 top
I5  1.27,20.95 0 top
I6  1.27,18.41 0 top
I7  1.27,15.24 0 top
I8  1.27,12.7 0 top
INPUT1  8.32,33.68 0 top
INPUT2  4.8,8.89 270 top
JP1  52.07,34.29 90 top
JP2  62.23,1.27 180 top
JP3  57.23,26.16 270 bottom
JP4  67.31,31.75 180 top
JP5  11.43,36.83 0 top
JP6  39.37,1.27 0 top
JP7  31.75,3.81 0 top
JP8  46.99,36.83 180 top
JP9  34.29,34.29 0 top
JP10  29.21,36.83 0 top
JP11  19.05,34.29 180 top
JP12  21.59,34.29 0 top
JP13  26.67,1.27 90 top
JP14  24.13,1.27 90 top
JP15  31.75,1.27 0 top
JP16  39.37,3.81 0 top
JP17  29.21,1.27 90 top
JP18  5.08,1.27 0 top
JP19  63.5,36.83 0 top
LOGO1  19.56,19.43 0 top
MPU  27.94,30.48 0 top
O1  67.31,28.57 180 top
O2  67.31,25.4 180 top
O3  67.31,22.23 180 top
O4  67.31,19.05 180 top
O5  67.31,15.88 180 top
O6  67.31,12.7 180 top
O7  67.31,9.53 180 top
O8  67.31,6.35 180 top
OUTPUT1  62.23,33.02 90 top
OUTPUT2  59.16,9.8 270 top
R1  15.72,11.4 180 top
R2  54.36,30.99 0 top
R3  12.7,29.21 90 top
R4  50.55,30.99 0 top
R5  15.24,29.21 270 top
R6  16.51,26.67 270 top
R7  34.29,8.89 180 top
R8  19.05,11.43 180 top
R9  34.29,7.62 180 top
R10  46.18,30.99 0 top
R11  42.93,30.99 0 top
R12  49.53,34.29 270 top
R13  34.29,10.16 180 top
R14  34.29,11.43 180 top
R15  57.15,30.48 180 top
R16  8.76,12.83 90 top
R17  8.89,24.13 270 top
R18  8.89,26.67 270 top
R19  8.76,15.37 90 top
R20  8.89,17.78 90 top
R21  8.89,29.21 270 top
R22  8.89,31.75 270 top
R23  8.89,20.32 90 top
R24  15.24,26.67 90 top
R25  24.13,29.21 270 top
S1  57.15,35.05 0 top
SJ1  62.23,3.81 0 top
STAT1  54.36,29.72 270 top
STAT2  50.55,29.72 270 top
STAT3  46.61,29.77 270 top
STAT4  42.67,29.77 270 top
U1  41.91,19.05 270 top
U3  20.32,15.24 180 top
U5  13.97,19.05 0 top
U6  16.51,7.62 270 top
U8  53.34,10.16 90 top
U9  21.59,7.62 270 top
U10  27.94,26.67 270 top
U$2  2.54,35.56 0 top
U$3  2.54,2.54 0 top
U$4  66.04,35.56 0 top
U$5  66.04,2.54 0 top
U$9  9.53,1.85 0 bottom
U$10  53.49,20.21 0 top
Y1  42.04,8.26 0 top

### Tracks (layer width: path | path; a pad name or v marks a point on that pad's centre or on a via)
3.3V  (via drill 0.33)
  Top 0.178: 36.4,15.85 U1.46 34.16,15.85 34.04,15.72 | 40.71,24.2 U1.16 40.71,27.26 38.87,29.1 C26.1 38.23,29.77 37.34,30.66 | 46.31,24.63 U1.2 | U1.62 41.51,13.54 | 47.31,18.25 U1.86 | U1.30 34.19,22.25 33.76,22.68 33.76,23.75 | 38.48,20.37 38.15,20.7 37.21,20.7 36.73,20.22 36.73,19.79 36.43,19.49 36.43,19.45 U1.37 34.65,19.45 34.65,19.46 33.86,19.46 33.73,19.58 33.05,19.58 32.92,19.71 | JP8.6 35.56,35.56 35.56,33.02 | U10.13 26.64,23.65 26.67,23.62
  Top 0.203: 40.64,24.13 40.71,24.2 | 46.35,24.59 46.31,24.63 | 41.51,13.54 41.58,13.61 | 47.31,18.25 47.27,18.29 | 36.4,15.85
  Top 0.61: R1.2 15.16,11.49
  Route5 0.406: v40.89,14.28 40.89,16.13 41.91,17.14 v41.91,19.05
  Route5 0.61: v19.43,28.96 19.3,28.83 15.24,28.83 13.97,30.1 JP11.3 | v26.21,12.8 26.21,17.3 24.13,19.38 24.13,21.74 24.11,21.89 v24.38,22.28
  Route10 0.406: 27.56,10.67 27.53,10.67 v27.48,10.72
  Route10 0.61: 27.56,10.67 27.81,10.41 31.24,10.41 v31.29,10.46
  Bottom 0.178: JP5.5 20.32,35.56 15.24,35.56 JP11.3
  Bottom 0.406: JP16.4 46.99,6.73 v48.49,8.23 46.99,9.73 46.99,11.43 45.72,12.7 41.91,12.7 40.89,13.72 v40.89,14.28
  Bottom 0.61: v19.43,28.96 19.43,24.51 21.59,22.35 24.31,22.35 v24.38,22.28 | v41.91,19.05 41.91,19.56 39.5,21.97 39.5,29.34 40.64,30.48 40.64,32.77 40.77,32.89
  other vias: 40.74,32.84
  pour Top (isolate 0.305): 0,38.1 0,0 68.58,0 68.58,38.1
5V  (via drill 0.33)
  Top 0.178: C6.A v22.48,16.76 | R6.2 16.51,25.4 v17.78,24.13
  Top 0.254: JP17.2 30.48,2.54 43.18,2.54 JP6.3
  Top 0.61: JP17.2 JP13.2 JP14.2 24.13,6.63 | C6.A 24,15.11 22.86,13.97 | 22.86,13.97 22.83,13.94 U3.5 21.27,13.02 24.13,10.16 24.13,6.63 | C8.1 23.48,13.35 22.86,13.97 | U9.2 24.12,6.62 24.13,6.63
  Route5 0.178: v22.48,16.76 22.48,19.43 v17.78,24.13
A-5V  (via drill 0.33)
  Top 0.178: C11.1 R24.2 R6.1 17.77,27.32 v17.78,27.3 | U1.24 37.51,26.75 37.34,26.92 36.58,26.92 v35.56,27.94
  Route10 0.178: v35.56,27.94 34.67,27.05 33.27,27.05 33.02,27.3 24.64,27.3 23.88,28.07 18.54,28.07 v17.78,27.3
A-VCC  (via drill 0.33)
  Top 0.178: C10.1 R3.1 R5.2 16.75,28.56 v17.91,29.72 | U1.25 36.48,25.75 v34.29,27.94
  Route10 0.178: v34.29,27.94 32.77,29.46 20.07,29.46 19.81,29.72 v17.91,29.72
AN15  (via drill 0.33)
  Top 0.178: U1.44 36.44,16.65 v36.98,17.2 | v35.53,29.84 33.68,29.84 32.18,31.34 32.18,33.86 JP12.5
  Route10 0.178: v36.98,17.2 36.98,17.37 36.2,18.16 36.2,24.51 38.81,27.13 38.81,27.51 36.47,29.84 v35.53,29.84
AN16  (via drill 0.33)
  Top 0.178: U1.6 44.71,24.25 45.29,23.67 v45.29,22.99
  Route10 0.178: v45.29,22.99 45.29,23.67 44.68,24.28 44.68,30.38 43.74,31.32 39.62,31.32 38.51,32.44 v38.05,32.44
  Bottom 0.178: JP12.4 30.48,33.02 37.47,33.02 v38.05,32.44
AN17  (via drill 0.33)
  Top 0.178: U1.7 44.31,23.53 44.45,23.39 v44.45,21.84
  Route10 0.178: v44.45,21.84 44.45,23.39 44.15,23.7 44.15,30.05 43.26,30.94 38.28,30.94 v38.15,30.81
  Bottom 0.178: v38.15,30.81 37.92,30.79 31.45,30.79 29.21,33.02 27.94,33.02 JP12.3
AN18  (via drill 0.33)
  Top 0.178: U1.8 43.91,23.29 v43.61,22.99
  Bottom 0.178: v43.61,22.99 43.61,20.34 42.8,19.53 42.8,18.57 42.32,18.09 41.35,18.09 40.39,19.05 40.39,19.81 38.35,21.84 38.23,21.97 37.9,22.3 25.91,22.3 25.07,23.14 22.58,23.14 20.32,25.4 20.32,30.48 JP12.2
AN23  (via drill 0.33)
  Top 0.178: 50.7,20.73 v51.03,21.06 50.62,20.65 U1.92
  Route5 0.178: JP7.3 36.83,4.24 37.95,5.36 47.52,5.36 v48.97,3.91
  Bottom 0.178: v51.03,21.06 52.07,20.02 52.07,13.97 50.8,12.7 50.8,7.62 49.1,5.92 49.1,4.04 v48.97,3.91
AN24  (via drill 0.33)
  Top 0.178: v50.49,22.23 50.11,21.84 50.11,21.23 49.93,21.05 U1.93
  Route5 0.178: v32.03,7.72 34.95,7.72 35.59,7.09 36.88,7.09 38.61,8.81 46.79,8.81 47.6,9.63 47.6,19.33 v50.49,22.23
  Route10 0.178: JP7.2 34.29,5.46 v32.03,7.72
CRX  (via drill 0.33)
  Top 0.178: U1.87 50.42,18.65 v50.44,18.67
  Route10 0.178: JP16.2 41.91,5.84 44.76,8.69 45.34,8.69 45.92,8.1 45.92,7.29 46.28,6.93 51.84,6.93 53.95,9.04 53.95,17.32 52.6,18.67 v50.44,18.67
CTS2  (via drill 0.33)
  Top 0.178: U1.40 38.09,18.25 38.53,17.81 v38.53,17.48 40.62,17.48 v40.72,17.53
  Route5 0.178: JP5.7 27.94,35.56 27.94,33.6 | 27.96,33.6 27.94,33.6 | v40.72,17.53 40.64,17.6 40.64,18.54 38.48,20.7 35.94,20.7 27.94,28.7 27.94,33.6
CTX  (via drill 0.33)
  Top 0.178: U1.88 49.58,19.05 49.78,19.25 49.78,19.53 v50.09,19.84
  Route10 0.178: v50.09,19.84 49.23,18.97 49.23,18.31 49.96,17.58 51.69,17.58 53.29,15.98 53.29,9.09 51.59,7.39 46.63,7.39 46.41,7.62 46.41,8.26 45.52,9.14 44.17,9.14 43.38,8.36 41.3,8.36 39.37,6.45 JP16.1
GND  (via drill 0.33)
  Top 0.178: 32.66,16.25 U1.45 | U1.15 41.11,28.13 v40.64,28.6 | U1.75 46.71,9.82 C24.2 | U1.65 42.71,13.98 v42.42,14.15 | U1.36 34.14,19.85 33.67,20.32 v33.67,20.4 | v42.06,7.54 Y1.2 | C13.2 v56.52,26.8 | U1.31 33.93,21.85 C27.2 | U6.4 16.82,4.62 v16.84,4.6 | U9.5 v21.35,3.62 v21.34,3.63 | U10.1 29.2,30.47 29.21,30.48 | C9.2 24.24,24.75 24.24,24.88 25.25,25.89 U10.11 | U10.18 29.2,24.02 29.73,23.48 30.34,23.48 v30.35,23.5 30.37,23.48
  Top 0.203: C21.2 32.66,16.25 | 40.21,29.73 C26.2
  Top 0.254: 21.46,7.75 21.16,7.75
  Top 0.406: JP16.3 JP6.4 | JP14.1 24.13,1.85 22.36,3.62
  Top 0.508: 67.31,31.77 65.76,33.33 63.42,33.33 63.09,33.66 62.31,33.66
  Top 0.61: 40.21,29.73 40.21,29.03 v40.64,28.6 | C24.2 47.15,9.7 v48.54,9.7 48.72,9.53 U8.7 | OUTPUT2.C 58.7,11.2 57.71,12.19 57.68,12.19 57.63,12.24 57.56,12.24 57.94,12.62 v58.4,12.78 | 58.42,5.15 58.35,5.15 55.96,7.54 U8.1 U8.2 U8.3 U8.4 | 58.42,5.15 C7.2 | C28.C 56.72,18.8 v56.77,18.75 | 67.31,31.77 JP4.1 | 62.31,33.66 62.26,33.71 62.26,33.76 62.23,33.78 | R8.1 20.78,11.43 v20.83,11.38 21.16,11.05 21.16,7.75 21.29,7.62 | I8.1 1.27,11.58 0.71,11.02 0.71,7.34 1.19,6.86 2.44,6.86 | C27.2 33.6,21.52 33.6,20.46 v33.67,20.4 | JP1.2 54.48,36.83 S1.1 | 54.61,36.83 56.13,35.31 60.71,35.31 62.23,33.78 | 62.23,33.78 OUTPUT1.2 | C1.2 12.32,8.1 v12.39,8.03 12.25,7.88 C12.- | 15.86,19.7 v15.24,20.32 | C3.2 19.92,19.7 20.32,19.3 v20.32,17.91 U3.2 | C6.C 26.8,14.75 v27.86,13.69 | U5.GND v13.97,20.32 | C8.2 24.78,13.48 v25.2,13.89 | v57.33,6.15 57.42,6.15 58.42,5.15 | 21.46,7.75 U9.1 | C10.2 C11.2 R24.1 v15.24,21.59 | R5.1 16.37,29.86 v16.38,29.84 | C2.2 30.37,23.48 | v25.27,24.13 24.75,24.13 C9.2 | C4.2 18.4,22.24 v18.03,22.61 | C23.2 32.4,17.78 | 32.4,17.78 C21.2 | v31.9,17.73 32.35,17.73 32.4,17.78 | MPU.2 29.21,30.48 v29.59,30.48
  Top 0.813: C5.C 4.04,6.86 v4.24,7.06 4.8,7.62 INPUT2.2
  Top 1.016: INPUT1.2 10.82,33.68 JP11.4
  Route5 0.178: 33.91,24.89 33.88,24.89 v33.86,24.92
  Route5 0.406: JP12.1 JP5.6
  Route5 0.61: v40.64,28.6 40.64,27.99 37.57,24.92 34.27,24.92 33.91,24.89
  Route10 0.61: v33.67,20.4 33.67,24.73 v33.86,24.92
  Bottom 0.406: JP6.4 48.01,2.29
  other vias: 12.7,21.59 12.7,20.32 12.7,19.05 13.97,19.05 15.24,19.05 13.97,21.59
  pour Bottom (isolate 0.305): 0,38.1 0,0 68.58,0 68.58,38.1
GPS_PPS  (via drill 0.33)
  Top 0.178: U1.67 43.51,11.38 44.09,10.79 44.53,10.79 44.6,10.87 44.65,10.82 v44.68,10.82 | U9.6 21.59,1.52 v21.46,1.4
  Route5 0.178: v30.48,8.89 34.72,8.89 35.61,8 36.45,8 37.16,8.71 37.16,8.89 36.55,9.5 36.55,10.9 37.36,11.71 43.79,11.71 v44.68,10.82
  Bottom 0.178: v21.46,1.4 21.72,1.4 22.86,2.54 22.86,7.77 24.51,9.42 29.95,9.42 v30.48,8.89
GPS_RX  (via drill 0.33)
  Top 0.178: U1.51 36.49,12.35 36.2,12.65 31.17,12.66 31,12.66 26.33,7.99 v26.18,7.99 | U9.3 20.1,5.62 v19.56,5.08 | U6.6 19.51,2.62 v19.68,2.79
  Route5 0.178: JP6.2 40.64,2.54 19.94,2.54 v19.68,2.79
  Route10 0.178: v19.68,2.79 19.61,2.87 19.61,5.08 19.61,5.28 21.87,7.54 25.73,7.54 v26.18,7.99
  Route10 0.61: v19.56,5.08 19.61,5.08
GPS_TX  (via drill 0.33)
  Top 0.178: U1.52 37.51,11.37 37.16,11.02 36.68,11.02 35.46,12.24 31.42,12.24 27.57,8.5 v27.58,7.96 | v16.19,3.59 16.22,3.62 U6.5 19.62,3.62 20.62,4.62 U9.4
  Route10 0.178: v16.19,3.59 16.19,3.06 17.83,1.42 20.1,1.42 21.31,2.63 22.29,2.63 22.85,3.19 22.85,4.38 24.82,6.35 26.67,6.35 27.58,7.26 v27.58,7.96
  Bottom 0.178: JP6.1 38.1,2.54 28.52,2.54 27.94,3.12 27.94,7.61 v27.58,7.96
I1  (via drill 0.33)
  Top 0.178: U1.68 43.91,14.46 v43.56,14.81 | R22.1 9.51,32.4 v10.16,31.75
  Route10 0.178: v43.56,14.81 43.56,14.86 43.18,15.24 40.64,15.24 39.37,13.97 33.02,13.97 30.18,16.82 26.98,16.82 25.83,17.96 25.83,18.62 22.86,21.59 17.78,21.59 15.24,24.13 13.97,24.13 11.76,26.34 11.76,30.15 v10.16,31.75
I2  (via drill 0.33)
  Top 0.178: R21.1 9.51,29.86 v10.16,29.21 | U1.69 44.31,14.21 v44.91,14.81
  Route10 0.178: v44.91,14.81 44.91,14.22 44.02,13.34 33.05,13.34 30.15,16.23 26.85,16.23 25.32,17.75 25.32,18.49 22.78,21.03 17.65,21.03 15.24,23.44 13.74,23.44 11.1,26.09 11.1,28.27 v10.16,29.21
I3  (via drill 0.33)
  Top 0.178: U1.70 44.71,13.44 46.1,14.83 v46.1,15.67 | R18.1 9.51,27.32 v10.16,26.67
  Route10 0.178: v46.1,15.67 46.1,14.83 44.17,12.9 32.89,12.9 30.07,15.72 26.75,15.72 24.84,17.63 24.84,18.36 22.68,20.52 17.5,20.52 15.27,22.76 13.54,22.76 10.16,26.14 v10.16,26.67
I4  (via drill 0.33)
  Top 0.178: U1.71 45.11,13.26 45.54,13.69 46.25,13.69 v46.38,13.82 | R17.1 10.14,24.78 v10.16,24.77
  Route10 0.178: v46.38,13.82 46.38,12.93 45.95,12.5 32.72,12.5 30.05,15.16 26.62,15.16 24.26,17.53 24.26,18.34 22.66,19.94 18.39,19.94 16.43,17.98 12.06,17.98 11.1,18.95 11.1,23.82 v10.16,24.77
I5  (via drill 0.33)
  Top 0.178: R23.1 9.54,19.67 v10.16,19.05 | U1.79 50.9,15.45 v50.93,15.44
  Route10 0.178: v10.16,19.05 11.68,17.53 16.64,17.53 18.64,19.53 22.5,19.53 23.75,18.29 23.75,17.35 26.39,14.71 29.9,14.71 32.51,12.09 46.23,12.09 49.59,15.45 50.9,15.45 v50.93,15.44
I6  (via drill 0.33)
  Top 0.178: U1.80 47.45,15.85 47.14,15.54 47.14,14.22 47.78,13.59 49.12,13.59 v49.28,13.44 | R20.1 v10.07,17.13 v10.08,17.14
  Route10 0.178: v49.28,13.44 48.18,13.44 46.43,11.68 28.7,11.68 23.22,17.17 23.22,18.21 22.33,19.1 18.85,19.1 16.74,16.99 10.21,16.99 10.11,17.09 10.11,17.12 v10.08,17.14
I7  (via drill 0.33)
  Top 0.178: U1.47 36.62,15.45 37.11,14.96 37.11,13.84 36.37,13.11 30.2,13.11 29.59,12.5 v29.57,12.5 | R19.1 10.12,14.72 v10.16,14.76
  Route5 0.178: v29.57,12.5 28.68,12.5 27.76,11.58 22.71,11.58 21.59,12.7 12.7,12.7 11.43,11.43 9.42,11.43 8.76,12.09 8.76,13.36 v10.16,14.76
I8  (via drill 0.33)
  Top 0.178: U1.48 36.26,15.05 36.58,14.73 36.58,14.05 36.12,13.59 29.79,13.59 v29.49,13.89 | R16.1 9.64,12.18 v10.16,12.7
  Route5 0.178: v29.49,13.89 29.26,13.89 27.36,11.99 22.99,11.99 21.77,13.21 10.67,13.21 v10.16,12.7
INT1
  Top 0.178: U1.18 39.91,27.4 34.29,33.02 33.6,33.02 33.02,33.6 33.02,35.56 JP10.2
INT2  (via drill 0.33)
  Top 0.178: U1.19 39.51,27.22 34.98,31.75 33.4,31.75 v33.02,32.13
  Route5 0.178: JP10.1 30.48,35.56 32.36,35.56 33.02,34.9 v33.02,32.13
LED1  (via drill 0.33)
  Top 0.178: v48.87,27.38 49.35,27.38 50.06,26.67 50.06,22.99 49.68,22.61 49.68,21.64 49.49,21.45 U1.94 | STAT1.C 55.11,28.03 v55.12,28.02
  Route5 0.178: v48.87,27.38 49.76,28.4 49.81,28.45 51.05,28.45 51.49,28.02 v55.12,28.02
LED2  (via drill 0.33)
  Top 0.178: STAT2.C 52.4,29.72 v52.45,29.67 | v49.23,26.04 49.68,25.58 49.68,23.19 49.54,23.05 U1.98
  Route5 0.178: v52.45,29.67 48.97,29.67 48.01,28.7 48.01,26.47 48.46,26.01 49.2,26.01 v49.23,26.04
LED3  (via drill 0.33)
  Top 0.178: U1.99 47.59,23.45 46.94,24.11 46.94,24.36 v47.55,24.97 | STAT3.C 47.37,29.77 v48.26,30.66
  Route5 0.178: v47.55,24.97 47.55,29.95 v48.26,30.66
LED4  (via drill 0.33)
  Top 0.178: U1.100 48.61,25.41 46.56,27.46 v46.56,27.43 | STAT4.C 43.42,29.07 42.93,28.57 v42.34,28.57
  Route5 0.178: v46.56,27.43 43.23,27.43 42.34,28.32 v42.34,28.57
MCLR  (via drill 0.33)
  Top 0.178: S1.3 57.02,33.15 57.8,32.37 R15.1 57.8,29.96 v58.55,29.21 57.8,28.46 C13.1
  Top 0.254: R12.1 51.42,34.94 JP1.1 53.72,34.29 54.61,33.4 S1.3
  Route5 0.178: 58.55,22.23 v58.55,29.21
  Route5 0.203: 58.55,22.23 55.88,19.56 55.88,9.91 60.2,5.59 60.2,3.3 59.82,2.92 51.18,2.92 JP2.6
MPU-CS  (via drill 0.33)
  Top 0.178: R25.1 24.78,29.86 v25.4,30.48 | U1.14 41.51,27.29 v41.78,27.56
  Route10 0.178: v41.78,27.56 39.5,27.56 36.45,30.61 30.48,30.61 29.84,31.24 26.16,31.24 v25.4,30.48
MPU-INT  (via drill 0.33)
  Top 0.178: U1.66 43.11,11.12 44.07,10.16 44.07,7.24 42.65,5.82 33.68,5.82 33.58,5.92 26.72,5.92 25.02,7.62 25.02,9.91 v25.91,10.79 | U10.12 25.82,24.73 26.04,24.51 26.04,21.72 v27.94,19.81
  Bottom 0.178: v25.91,10.79 25.91,10.92 24.13,12.7 24.13,16 v27.94,19.81
MPU-SCK  (via drill 0.33)
  Top 0.178: U1.10 43.11,23.43 42.8,23.11 42.8,22.23 v42.93,22.1 | U10.23 31.75,27.43 v32.77,26.42
  Route5 0.178: v32.77,26.42 32.77,24.64 36.07,21.34 42.16,21.34 v42.93,22.1
MPU-SDI  (via drill 0.33)
  Top 0.178: U1.11 42.71,23.66 42.04,22.99 42.04,21.72 41.53,21.21 39.88,21.21 v37.97,23.11 | U10.24 30.99,27.94 v31.24,28.19
  Bottom 0.178: v31.24,28.19 32.89,28.19 v37.97,23.11
MPU-SDO  (via drill 0.33)
  Top 0.178: U10.9 23.75,26.93 v23.37,27.3 | U1.12 42.31,24.28 41.15,23.11 v41.15,22.1
  Route10 0.178: v41.15,22.1 38.35,22.1 36.83,20.57 36.83,18.54 37.72,17.65 37.72,16.64 37.34,16.26 34.42,16.26 v23.37,27.3
N$1
  Top 0.203: STAT1.A 53.61,30.89 R2.1
N$2
  Top 0.203: STAT2.A 49.8,30.89 R4.1
N$3
  Top 0.178: U1.64 42.32,11.18 43.31,10.19 43.31,8.91 | 43.31,8.91 | Y1.3 43.24,8.85 43.31,8.91
N$4
  Top 0.61: C12.+ 12.04,1.88 13.97,3.81 13.97,6.35 14.24,6.62 U6.2
N$5
  Top 0.178: U10.8 25.26,27.43 R25.2
N$6
  Top 0.178: U1.63 41.91,11.02 42.42,10.52 42.42,9.91 41.91,9.4 41.2,9.4 40.95,9.14 40.95,8.36 Y1.1
N$7  (via drill 0.33)
  Top 0.178: R15.2 56.5,29.38 v56.83,29.05 | U1.13 41.91,24.56 v40.41,23.06
  Bottom 0.178: 50.8,29.21 46.56,29.21 v40.41,23.06 | 55.27,30.61 v56.83,29.05
  Bottom 0.203: 50.8,29.21 50.8,29.5 51.91,30.61 55.27,30.61
N$9
  Top 0.61: R1.1 16.3,11.48 | R1.1 18.38,11.4 R8.2 | U5.ADJ 16.25,11.53 R1.1
N$13
  Top 0.178: U10.20 31.26,25.89 31.75,25.4 C2.1
N$14
  Top 0.254: R16.2 7.13,13.48 I8.3
N$15
  Top 0.254: R17.2 6.37,23.48 I4.3
N$16
  Top 0.178: U10.10 24.47,26.39 C9.1
N$17
  Top 0.254: R18.2 7,26.02 I3.3
N$18
  Top 0.254: R19.2 7.13,16.02 I7.3
N$19
  Top 0.254: R20.2 6.37,18.43 I6.3
N$20
  Top 0.254: R21.2 7,28.56 I2.3
N$21
  Top 0.254: R22.2 7,31.1 I1.3
N$27
  Top 0.254: R23.2 6.37,20.97 I5.3
N$33
  Top 0.203: STAT3.A 45.86,30.86 R10.1
N$34
  Top 0.203: STAT4.A 41.92,30.63 R11.1
N$35
  Top 0.178: U1.85 51.25,17.85 C28.A
O1  (via drill 0.33)
  Top 0.178: U1.72 45.51,8.04 v45.03,7.57
  Route5 0.178: 54.61,21.46 56.44,23.29 57.15,23.29 57.63,23.29 v57.66,23.29 | 54.61,8.89 52.98,7.26 45.34,7.26 v45.03,7.57
  Route5 0.203: 54.61,8.89 54.61,21.46
  Route10 0.178: v57.66,23.29 58.85,23.29 60.33,24.77 60.33,26.67 O1.3
O2
  Top 0.178: O2.3 63.5,24.13 63.5,15.24 62.56,14.3 61.57,14.3 60.91,13.64 50.32,13.64 49.71,14.25 U1.76
O3
  Top 0.178: O3.3 60.96,20.95 60.96,16.51 58.65,14.2 50.39,14.2 49.94,14.65 U1.77
O4  (via drill 0.33)
  Top 0.178: U1.78 50.13,15.05 50.55,14.63 57.81,14.63 v59.69,16.51
  Route5 0.178: v59.69,16.51 O4.3
O5  (via drill 0.33)
  Top 0.178: U1.81 58.16,16.25 v58.42,16.51
  Route5 0.178: v58.42,16.51 59.69,15.24 61.59,15.24 O5.3
O6  (via drill 0.33)
  Top 0.178: U1.82 57.34,16.65 58.9,18.21 v59.54,18.21
  Route10 0.178: O6.3 60.96,13.97 60.96,17.14 59.89,18.21 v59.54,18.21
O7  (via drill 0.33)
  Top 0.178: U1.83 57.03,17.05 58.9,18.92 58.9,19.61 59.77,20.47 v59.97,20.47
  Route10 0.178: O7.3 62.23,10.16 57.15,15.24 57.15,17.65 v59.97,20.47
O8  (via drill 0.33)
  Top 0.178: U1.84 56.69,17.45 58.37,19.13 58.37,20.37 v58.73,20.73
  Route10 0.178: O8.3 62.23,7.62 55.88,13.97 55.88,19.56 57.02,20.7 58.7,20.7 v58.73,20.73
PGEC2
  Top 0.178: U1.74 46.31,7.74 46.89,7.16 53.8,7.16 JP2.2
PGED2
  Top 0.178: U1.73 45.91,7.25 46.74,6.43 51.99,6.43 JP2.3
RA1  (via drill 0.33)
  Top 0.178: U1.38 36.83,19.05 v37.67,19.89
  Route10 0.178: JP15.2 33.02,2.54 v33.02,5.08
  Bottom 0.178: v33.02,5.08 33.02,13.97 35.56,16.51 35.56,17.78 v37.67,19.89
RA4  (via drill 0.33)
  Top 0.178: U1.60 40.71,9.85 38.91,8.05 39.17,7.8 v39.19,7.8
  Route10 0.178: JP15.3 35.56,2.54 35.56,5.08 38.28,7.8 v39.19,7.8
RA5  (via drill 0.33)
  Top 0.178: U1.61 41.11,10.63 v41.53,10.21
  Bottom 0.178: JP7.1 31.75,6.3 30.56,7.49 30.56,7.59 32.49,9.53 32.49,14.25 35,16.76 35,18.62 37.24,20.85 38.68,20.85 39.88,19.66 39.88,11.86 v41.53,10.21
RTS2  (via drill 0.33)
  Top 0.178: U1.39 38.44,18.65 v38.71,18.92
  Route5 0.178: JP5.2 15.24,35.56 20.19,35.56 20.32,35.43 20.32,30.48 21.21,29.59 21.21,25.02 22.61,23.62 24.77,23.62 25.91,22.48 25.91,19.81 29.95,15.77 38.48,15.77 39.8,17.09 39.8,17.83 v38.71,18.92
RX2
  Top 0.178: U1.49 31.43,14.65 27.13,18.95 23.6,18.95 21.84,20.7 21.84,31.5 20.32,33.02 20.32,35.56 JP5.4
SCK1  (via drill 0.33)
  Top 0.178: U1.55 38.71,14.17 40.01,15.47 42.04,15.47 42.22,15.65 44.04,15.65 v45.87,17.48
  Route10 0.178: v45.87,17.48 45.87,17.93 48.64,20.7 48.64,25.25 47.68,26.21 47.68,28.96 49.12,30.4 49.12,34.7 JP8.1
SCL1  (via drill 0.33)
  Top 0.178: R13.1 35.37,9.73 v37.52,9.73 37.74,10.03 38.68,10.03 39.51,10.88 U1.57 | 48.56,10.97 v48.54,11 48.74,10.79 U8.6
  Route10 0.178: v48.54,11 47.4,11 45.95,9.55 43.92,9.55 43.18,8.81 38.33,8.81 v37.52,9.73 | v37.52,9.73 37.47,9.78 | v37.52,9.73 37.59,9.55
SCL2  (via drill 0.33)
  Top 0.178: R7.1 v36.02,8.89 38.41,8.89 39.91,10.39 U1.58
  Route5 0.178: JP11.1 19.05,30.48 20.45,29.08 20.45,24.77 22.1,23.11 24.64,23.11 25.15,22.61 25.15,19.81 30.61,14.35 33.91,14.35 36.02,12.24 v36.02,8.89
SDA1  (via drill 0.33)
  Top 0.178: U1.56 39.11,11.09 38.66,10.64 38.1,10.64 | 38.1,10.64 35.73,10.64 R14.1 | v38.2,10.85 38.2,10.74 38.1,10.64 | 48.64,12.24 v48.54,12.34 48.82,12.06 U8.5
  Route10 0.178: v48.54,12.34 47.9,12.34 45.54,9.98 43.69,9.98 43,9.3 39.75,9.3 v38.2,10.85
SDA2  (via drill 0.33)
  Top 0.178: JP11.2 16.51,33.53 18.29,31.75 19.68,31.75 20.83,30.61 20.83,20.19 21.72,19.3 v21.72,18.29 | v28.97,7.82 30.48,6.35 34.42,6.35 34.92,6.86 34.92,7.61 R9.1 37.74,7.62 40.31,10.19 U1.59
  Route10 0.178: v28.97,7.82 27.94,8.89 26.67,8.89 21.72,13.84 v21.72,18.29
SDI1  (via drill 0.33)
  Top 0.178: U1.54 38.31,14.66 39.67,16.03 43,16.03 v44.45,17.48
  Route10 0.178: v44.45,17.48 44.45,17.27 43.69,16.51 42.72,16.51 42.06,17.17 42.06,17.68 43.33,18.95 45.31,18.95 46.33,19.96 46.33,23.88 45.24,24.97 45.24,31.39 44.45,32.18 44.45,32.59 44.02,33.02 43.76,33.02 43.18,33.6 43.18,35.56 JP8.3
SDO1  (via drill 0.33)
  Top 0.178: U1.53 37.91,15.05 39.47,16.61 42.24,16.61 v43.1,17.48
  Route10 0.178: v43.1,17.48 43.1,17.58 43.94,18.41 45.54,18.41 46.91,19.79 46.91,24.38 45.74,25.55 45.74,31.39 46.53,32.18 46.53,32.94 45.7,33.78 45.7,35.59 JP8.2
SS1  (via drill 0.33)
  Top 0.178: U1.23 37.91,27.01 37.19,27.74 v37.11,27.74
  Route5 0.178: JP8.4 38.1,35.56 38.1,33.43 37.11,32.44 v37.11,27.74
SVCC
  Top 0.406: SJ1.2 62.71,3.81 62.74,3.79 | 64.77,7.9 64.69,7.98
  Top 0.61: O8.2 64.77,5.08 63.48,3.79 62.74,3.79 | OUTPUT2.A 60.68,8.4 61.11,7.98 64.69,7.98
  Top 0.813: JP4.2 62.85,31.75 OUTPUT1.1
  Top 1.27: O8.2 64.77,7.9 O7.2 O6.2 O5.2 O4.2 O3.2 O2.2 O1.2 JP4.2
TX2
  Top 0.178: JP5.3 17.78,35.56 17.78,33.15 18.54,32.38 20.17,32.38 21.34,31.22 21.34,20.4 23.37,18.36 26.9,18.36 31.01,14.25 U1.50
VCC  (via drill 0.33)
  Top 0.178: R3.2 12.7,30.73 v12.45,30.99 | v6.48,33.66 6.38,33.66 6.35,33.68
  Top 0.406: 61.78,3.85 SJ1.1
  Top 0.61: C7.1 61.78,3.85 | U3.3 19.37,15.55 19.68,15.24 20.95,15.24 21.27,15.55 U3.1 | C3.1 19.05,16.86 U3.3 | v18.16,16.13 18.96,16.13 U3.3 | U5.VIN 12.62,13.54 12.29,13.54 11.9,13.54 U5.EN
  Top 0.889: INPUT2.1 4.8,10.36 5.08,10.64 | C7.1 59.09,3.85 v59.05,3.96
  Top 1.016: INPUT1.1 6.35,33.68 5.74,33.68 I1.2
  Top 1.27: 3.81,10.64 3.35,10.64 C5.A | 3.81,10.64 5.08,10.64 10.82,10.64 12.29,12.12 12.29,13.54 | 3.81,10.64 3.83,10.67 3.83,11.2 3.81,11.23 I8.2 I7.2 I6.2 I5.2 I4.2 I3.2 I2.2 I1.2
  Route5 0.178: v12.45,30.99 12.45,31.37 11.18,32.64 7.49,32.64 v6.48,33.66
  Route5 0.61: v18.16,16.13 8,16.13 7.37,16.76 5.33,16.76 I7.2
  Route5 0.813: 50.8,3.81 58.9,3.81 v59.05,3.96
  Route5 0.889: 50.8,3.81 48.26,6.35 10.16,6.35 I8.2

### Text on the board
Bottom: v010
tPlace: - | + | + | - | Reset | 4 | 3 | 2 | 1 | direction | flight | of | UDB5 | - | + | D2523T | EM406 | + | -
bPlace: GND | GND | - | + | + | - | RTS | TX2 | RX2 | 3.3 | 3.3 | GND | CTS | IN2 | IN1 | 3.3 | GND | SS1 | DI1 | DO1 | CK1 | GND | 1 | 3.3 | SDA | SCL | GND | A18 | A17 | A16 | A15 | GND | GND | GND | GND | GND | GND | MCLR | OUTPUT | 2 | 1 | 3 | 2 | 4 | 3 | 5 | 4 | 6 | 7 | 5 | 8 | 6 | - | + | INPUT | 7 | 5V | 5V | 5V | RA5 | A24 | A23 | CTX | CRX | GND | 3.3 | 8 | GND | GND | GND | - | RA1 | RA4 | GTX | GRX | 5V | GND | + | - | ICSP